# EasyEDA Pro project 同反向放大加减法通板.eprj

# Schematic Schematic1
Board Name: Board1; Create Date: 2024-07-23; Page Name: P1; Project Name: 同反向放大加减法通板; Schematic Name: Schematic1; Update Date: 2025-07-16; Company: 嘉立创EDA; Page Size: A4; Version: V1.0
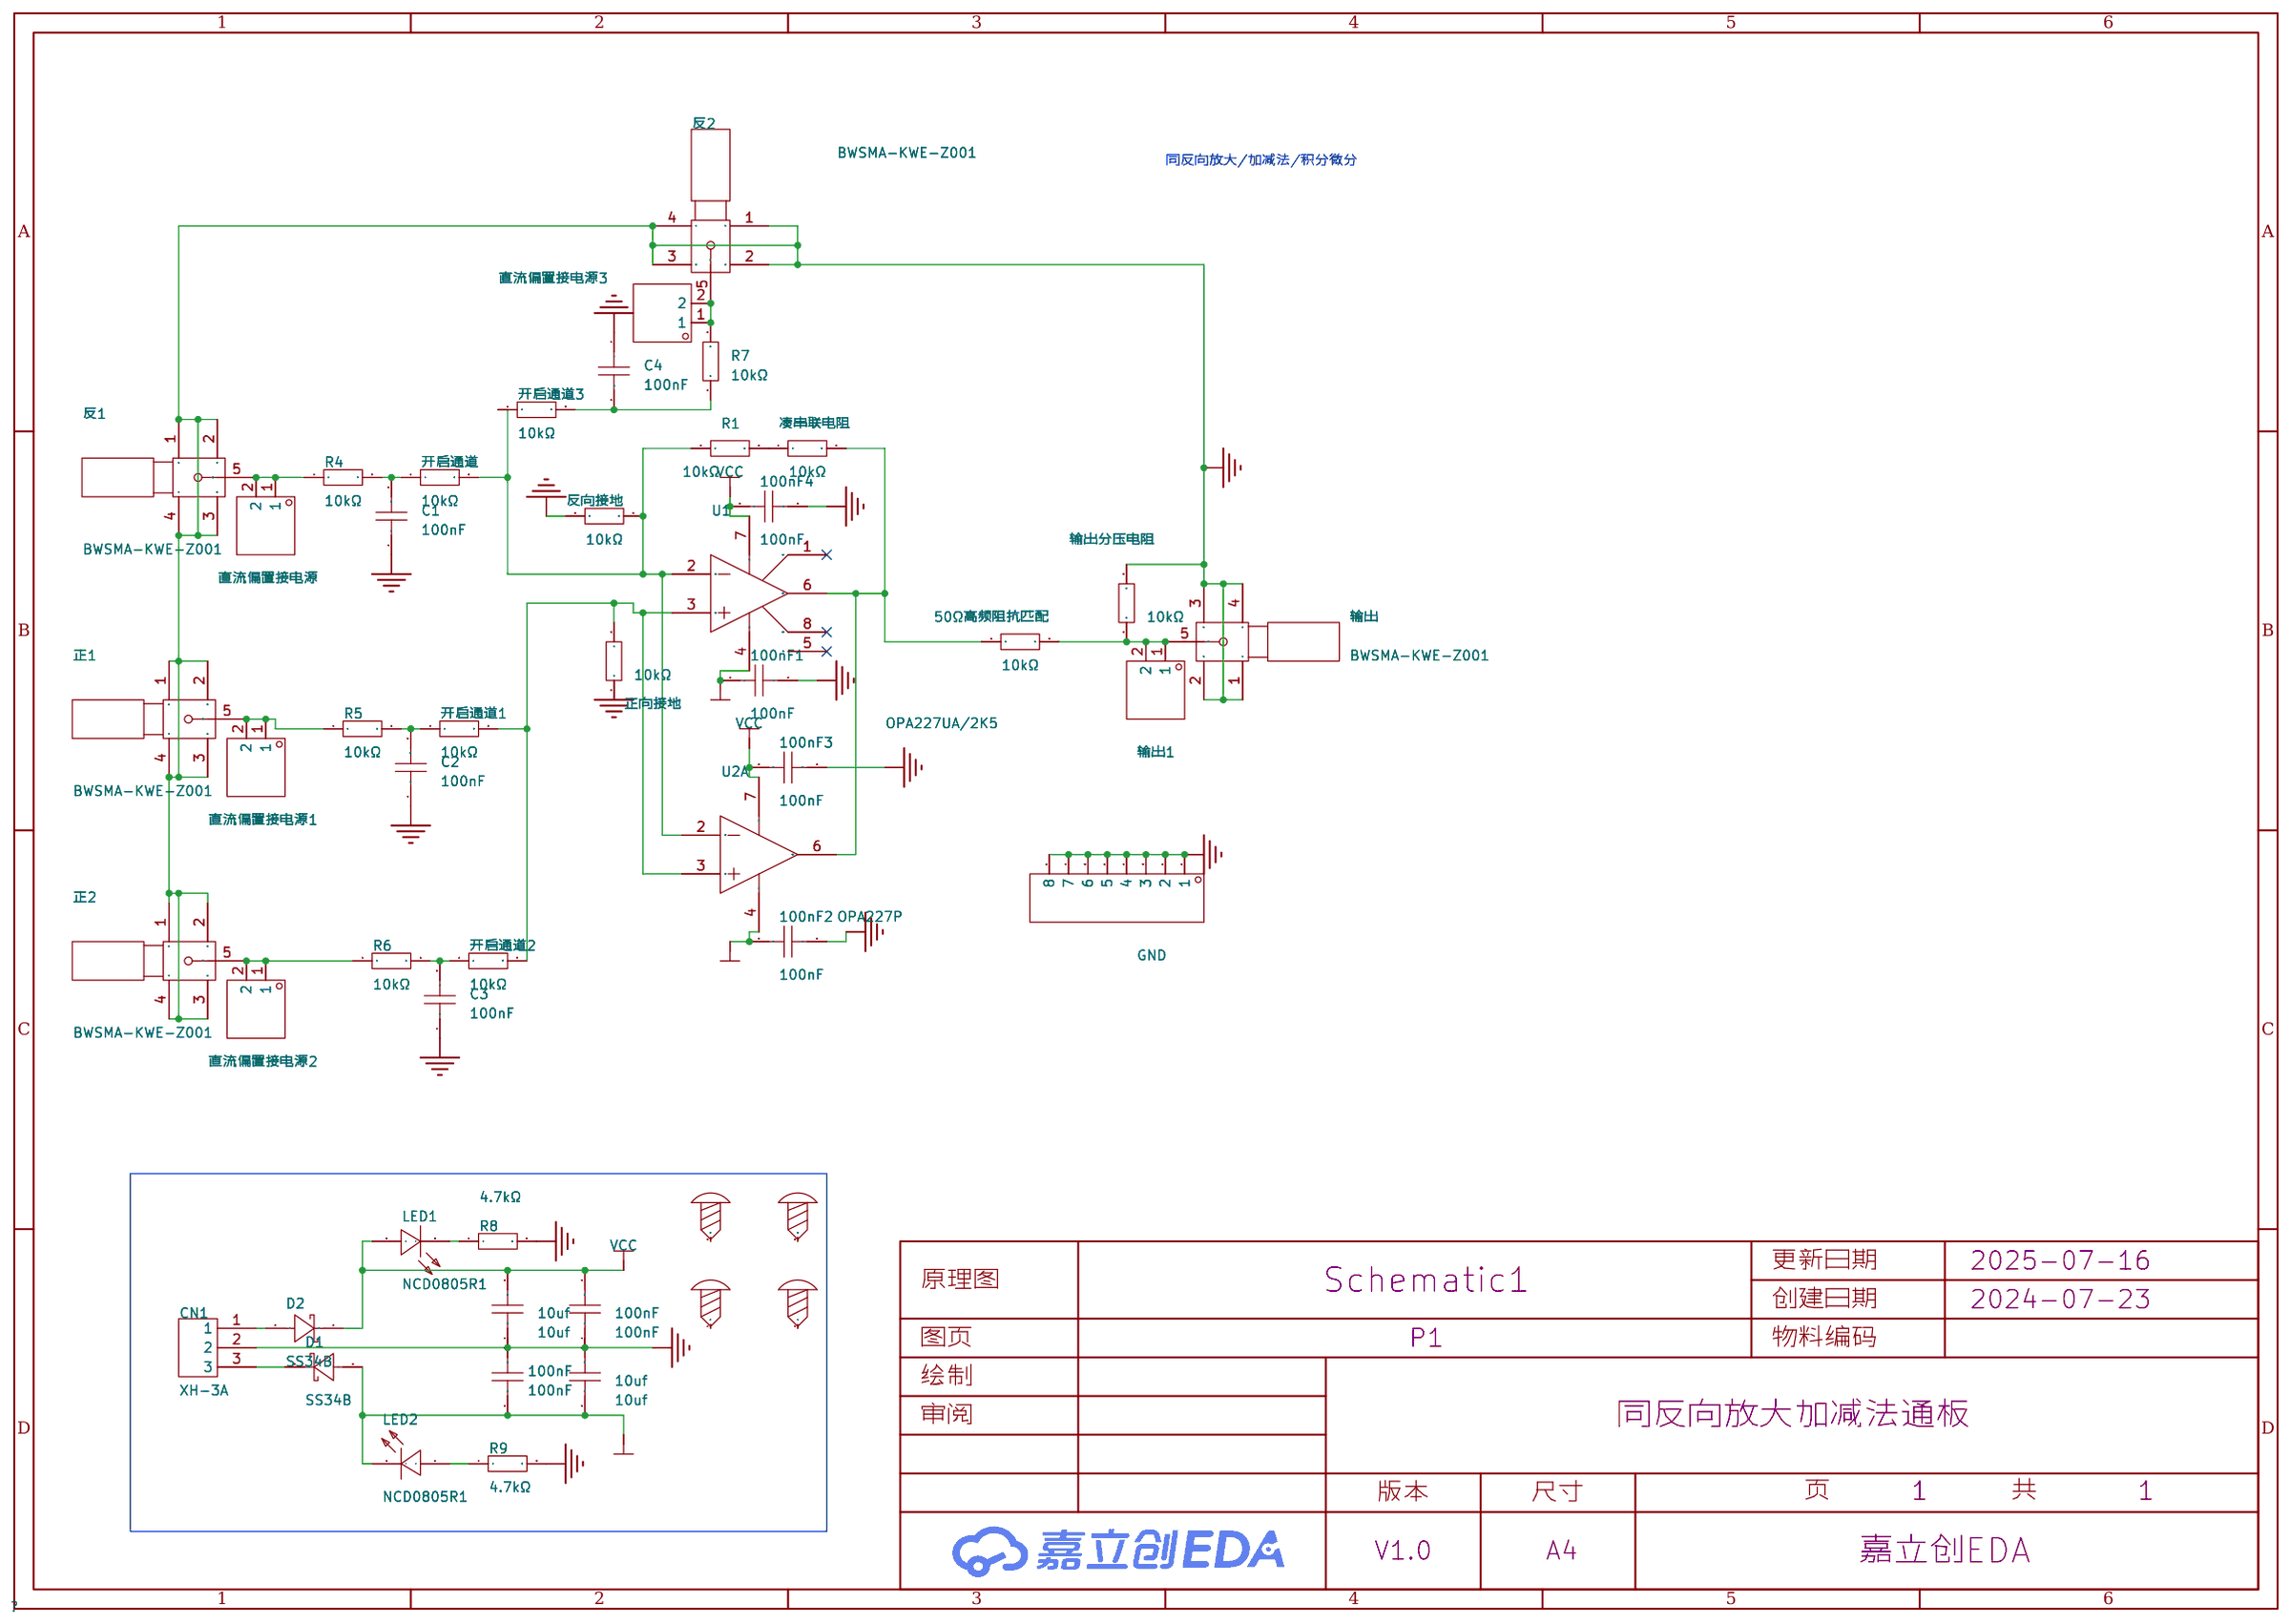
[diagram p0: schematic sheet]

## Parts
10uf  10uf  [C0805]
10uf#2  10uf  [C0805]
50Ω高频阻抗匹配  10kΩ  [R0805]
100nF  100nF  [C0805]
100nF1  100nF  [C0805]
100nF2  100nF  [C0805]
100nF3  100nF  [C0805]
100nF4  100nF  [C0805]
100nF#2  100nF  [C0805]
C1  100nF  [C0805]
C2  100nF  [C0805]
C3  100nF  [C0805]
C4  100nF  [C0805]
CN1  XH-3A  [CONN-TH_XH-3A]
D1  SS34B  [SMB_L4.6-W3.5-LS5.3-RD]
D2  SS34B  [SMB_L4.6-W3.5-LS5.3-RD]
GND  -  [HDR-TH_8P-P2.54-V-M]
LED1  NCD0805R1  [LED0805-R-RD]
LED2  NCD0805R1  [LED0805-R-RD]
R1  10kΩ  [R0805]
R4  10kΩ  [R0805]
R5  10kΩ  [R0805]
R6  10kΩ  [R0805]
R7  10kΩ  [R0805]
R8  4.7kΩ  [R0805]
R9  4.7kΩ  [R0805]
SCREW1  -  [M3螺丝]
SCREW2  -  [M3螺丝]
SCREW3  -  [M3螺丝]
SCREW4  -  [M3螺丝]
U1  OPA227UA/2K5  [SOIC-8_L4.9-W3.9-P1.27-LS6.0-BL]
U2  OPA227P  [PDIP-8_L9.3-W6.4-P2.54-LS7.9-BL-1]  (section 1)
凑串联电阻  10kΩ  [R0805]
反1  BWSMA-KWE-Z001  [SMA-TH_BWSMA-KWE-Z001]
反2  BWSMA-KWE-Z001  [SMA-TH_BWSMA-KWE-Z001]
反向接地  10kΩ  [R0805]
开启通道  10kΩ  [R0805]
开启通道1  10kΩ  [R0805]
开启通道2  10kΩ  [R0805]
开启通道3  10kΩ  [R0805]
正1  BWSMA-KWE-Z001  [SMA-TH_BWSMA-KWE-Z001]
正2  BWSMA-KWE-Z001  [SMA-TH_BWSMA-KWE-Z001]
正向接地  10kΩ  [R0805]
直流偏置接电源  -  [HDR-TH_2P-P2.54-V-M-1]
直流偏置接电源1  -  [HDR-TH_2P-P2.54-V-M-1]
直流偏置接电源2  -  [HDR-TH_2P-P2.54-V-M-1]
直流偏置接电源3  -  [HDR-TH_2P-P2.54-V-M-1]
输出  BWSMA-KWE-Z001  [SMA-TH_BWSMA-KWE-Z001]
输出1  -  [HDR-TH_2P-P2.54-V-M-1]
输出分压电阻  10kΩ  [R0805]

## Library data of the parts
10uf 10uf#2 100nF 100nF1-100nF4 100nF#2 C1-C4 = CC0805KRX7R9BB104: 容值:100nF;精度:±10%;额定电压:50V;材质(温度系数):X7R;; LCSC Part Name: 100nF ±10% 50V; Supplier Part: C49678; Manufacturer: YAGEO(国巨); Supplier Footprint: 0805; JLCPCB Part Class: Basic Part; Datasheet: https://atta.szlcsc.com/upload/public/pdf/source/20180224/C181747_15194369449651363981.pdf; Supplier: LCSC; Tolerance: ±10%; Voltage Rated: 50V; Temperature Coefficient: X7R
50Ω高频阻抗匹配 R1 R4-R9 凑串联电阻 反向接地 开启通道 开启通道1-开启通道3 正向接地 输出分压电阻 = 0805W8F1002T5E_C17414: 电阻类型:厚膜电阻;阻值:10kΩ;精度:±1%;功率:125mW;最大工作电压:150V;温度系数:±100ppm/℃;; LCSC Part Name: 10kΩ ±1% 125mW 厚膜电阻; Supplier Part: C17414; Manufacturer: UNI-ROYAL(厚声); Manufacturer Part: 0805W8F1002T5E; Supplier Footprint: 0805; JLCPCB Part Class: Basic Part; Datasheet: https://atta.szlcsc.com/upload/public/pdf/source/20200306/C422600_1E6D84923E4A46A82E41ADD87F860B5C.pdf; Supplier: LCSC; Type: 厚膜电阻; Tolerance: ±1%; Power(Watts): 125mW; Overload Voltage (Max): 150V; Temperature Coefficient: ±100ppm/℃; Operating Temperature Range: -55℃~+155℃
CN1 = XH-3A_C2316: 插针结构:1x3P;间距:2.5mm;安装方式:-;参考系列:XH;总PIN数:3P;排数:1;每排PIN数:3;行距:-;触头材质:-;; LCSC Part Name: 1x3P 间距:2.5mm 系列:XH; Supplier Part: C2316; Manufacturer: BOOMELE(博穆精密); Supplier Footprint: 插件,P=2.5mm; JLCPCB Part Class: Extended Part; Datasheet: https://atta.szlcsc.com/upload/public/pdf/source/20151222/1457707654251.pdf; Supplier: LCSC; Pins Structure: 1x3P; Pitch: 2.5mm; Reference Series: XH; Number of Pins: 3P; Number of Rows: 1; Number of PINs Per Row: 3
D1 D2 = SS34B_C7420366: LCSC Part Name: 电压:40V 电流:3A; Supplier Part: C7420366; Manufacturer: 宏嘉诚; Supplier Footprint: SMB; JLCPCB Part Class: 扩展库; Datasheet: https://atta.szlcsc.com/upload/public/pdf/source/20250121/6ECF561C2C3BC4B2993ABD3B603F350E.pdf; Supplier: LCSC; Diode Configuration: 独立式; Voltage - Forward(Vf@If): 550mV@3.0A; Voltage - DC Reverse(Vr): 40V; Current - Rectified: 3A; Reverse Leakage Current (Ir): 200uA@40V
GND = HDR-M_2.54_1x8P: Supplier Part: C124381; Supplier Footprint: 插件
LED1 LED2 = NCD0805R1: 灯头类型:-;发光颜色:红色;正向电压(VF):1.6V~2.6V;功率:65mW;正向电流:20mA;主波长:615nm~630nm;二极管配置:独立二极管;透镜颜色:无色透明透镜;色温:-;发光强度:67mcd~195mcd;发光角度:130°;载带方式:-;工作温度:-30℃~+85℃;; Supplier Part: C84256; Manufacturer: 国星光电; Supplier Footprint: 0805; JLCPCB Part Class: Basic Part; Datasheet: https://atta.szlcsc.com/upload/public/pdf/source/20200820/C84256_F0A75A43B3EAD75808600A0514C76B99.pdf; Supplier: LCSC; Emitted Color: 红色; Forward Voltage (VF): 1.6V~2.6V; Power Dissipation: 65mW; Forward Current: 20mA; Dominant Wavelength: 615nm~630nm; Diode Configuration: 独立二极管; Lens Color: 无色透明透镜; Luminous Intensity: 67mcd~195mcd; Viewing Angle: 130°; Operating Temperature: -30℃~+85℃
SCREW1-SCREW4 = M3螺丝: Supplier Footprint: 插件
U1 = OPA227UA/2K5: 放大器数:单路;增益带宽积(GBP):8MHz;输入偏置电流(Ib):2.5nA;压摆率(SR):2.3V/us;轨到轨:-;; Supplier Part: C456278; Manufacturer: TI(德州仪器); Supplier Footprint: SOIC-8; JLCPCB Part Class: Extended Part; Datasheet: https://www.ti.com/cn/lit/gpn/opa227; Supplier: LCSC; Number of Circuits: 单路; Gain Bandwidth Product(GBP): 8MHz; Current - Input Bias(Ib): 2.5nA; Slew Rate(SR): 2.3V/us; Output Current: 45mA; Operating Temperature: -40℃~+85℃
U2 = OPA227P: 放大器数:单路;增益带宽积(GBP):8MHz;输入偏置电流(Ib):2.5nA;压摆率(SR):2.3V/us;轨到轨:-;; Supplier Part: C1348575; Manufacturer: TI(德州仪器); Supplier Footprint: PDIP-8; JLCPCB Part Class: Extended Part; Datasheet: https://www.ti.com/cn/lit/gpn/opa4228; Supplier: LCSC; Number of Circuits: 单路; Gain Bandwidth Product(GBP): 8MHz; Current - Input Bias(Ib): 2.5nA; Slew Rate(SR): 2.3V/us; Output Current: 45mA; Operating Temperature: -40℃~+85℃
反1 反2 正1 正2 输出 = BWSMA-KWE-Z001: 连接器类型:板端;接口类型:内孔;端口数量:1;接口直径:5.3mm;接口长度/高度:-;频率-最大值:-;射频系列:SMA;阻抗:50Ω;样式:弯头;触头材质:-;触头镀层:-;工作温度范围:-;焊接温度(最大值):-;; LCSC Part Name: 内孔 SMA 弯头; Supplier Part: C496551; Manufacturer: BAT WIRELESS(蝙蝠无线); Supplier Footprint: 插件; JLCPCB Part Class: Extended Part; Datasheet: https://atta.szlcsc.com/upload/public/pdf/source/20231017/997A8C2ADA7F8034A89BE1264F38CE52.pdf; Supplier: LCSC; Connector Type: 板端; Interface Type: 内孔; Number of Ports: 1; Interface Diameter: 5.3mm; RF Series: SMA; Impedance: 50Ω; Style: 弯头
直流偏置接电源 直流偏置接电源1-直流偏置接电源3 输出1 = HDR-M_2.54_1x2P: Supplier Part: C124375; Supplier Footprint: 插件

## Nets
GND: 10uf.1 10uf#2.2 100nF.1 100nF1.1 100nF2.1 100nF3.1 100nF4.1 100nF#2.2 C1.1 C2.1 C3.1 C4.1 CN1.2 GND.1 GND.2 GND.3 GND.4 GND.5 GND.6 GND.7 GND.8 R8.2 R9.2 反1.1 反1.2 反1.3 反1.4 反2.1 反2.2 反2.3 反2.4 反向接地.2 正1.1 正1.2 正1.3 正1.4 正2.1 正2.2 正2.3 正2.4 正向接地.1 输出.1 输出.2 输出.3 输出.4 输出分压电阻.2
VCC: 10uf.2 100nF.2 100nF3.2 100nF4.2 D2.1(K) LED1.1(+) U1.7(VCC) U2.7(V+)
VEE: 10uf#2.1 100nF1.2 100nF2.2 100nF#2.1 D1.2(A) LED2.2(-) U1.4(VSS) U2.4(V-)
$1N1330: R1.2 凑串联电阻.1
$1N1539: 50Ω高频阻抗匹配.2 输出.5 输出1.1 输出1.2 输出分压电阻.1
$1N2313: R4.1 反1.5 直流偏置接电源.1 直流偏置接电源.2
$1N2329: R5.1 正1.5 直流偏置接电源1.1 直流偏置接电源1.2
$1N2343: R6.1 正2.5 直流偏置接电源2.1 直流偏置接电源2.2
$1N2447: R7.2 反2.5 直流偏置接电源3.1 直流偏置接电源3.2
$1N2462: C4.2 R7.1 开启通道3.2
$1N2689: 50Ω高频阻抗匹配.1 U1.6(OUT) U2.6(OUT) 凑串联电阻.2
$1N5425: LED1.2(-) R8.1
$1N5450: LED2.1(+) R9.1
Net-(C1-2): C1.2 R4.2 开启通道.1
Net-(C2-2): C2.2 R5.2 开启通道1.1
Net-(C3-2): C3.2 R6.2 开启通道2.1
Net-(CN1-1): CN1.1 D2.2(A)
Net-(CN1-3): CN1.3 D1.1(K)
Net-(R1-1): R1.1 U1.2(VIN-) U2.2(IN(-)) 反向接地.1 开启通道.2 开启通道3.1
Net-(U1-3): U1.3(VIN+) U2.3(IN(+)) 开启通道1.2 开启通道2.2 正向接地.2

Not connected (* = marked no-connect by the designer): SCREW1 1; SCREW2 1; SCREW3 1; SCREW4 1; U1 1(TRIM)* 5(NC)* 8(TRIM)*

## Notes on the sheet
- 同反向放大/加减法/积分微分

# Schematic Schematic1_1
Board Name: 新; Create Date: 2025-07-27; Page Name: 新; Project Name: 同反向放大加减法通板; Schematic Name: Schematic1_1; Update Date: 2025-07-27; Company: 嘉立创EDA; Page Size: A4; Version: V1.0
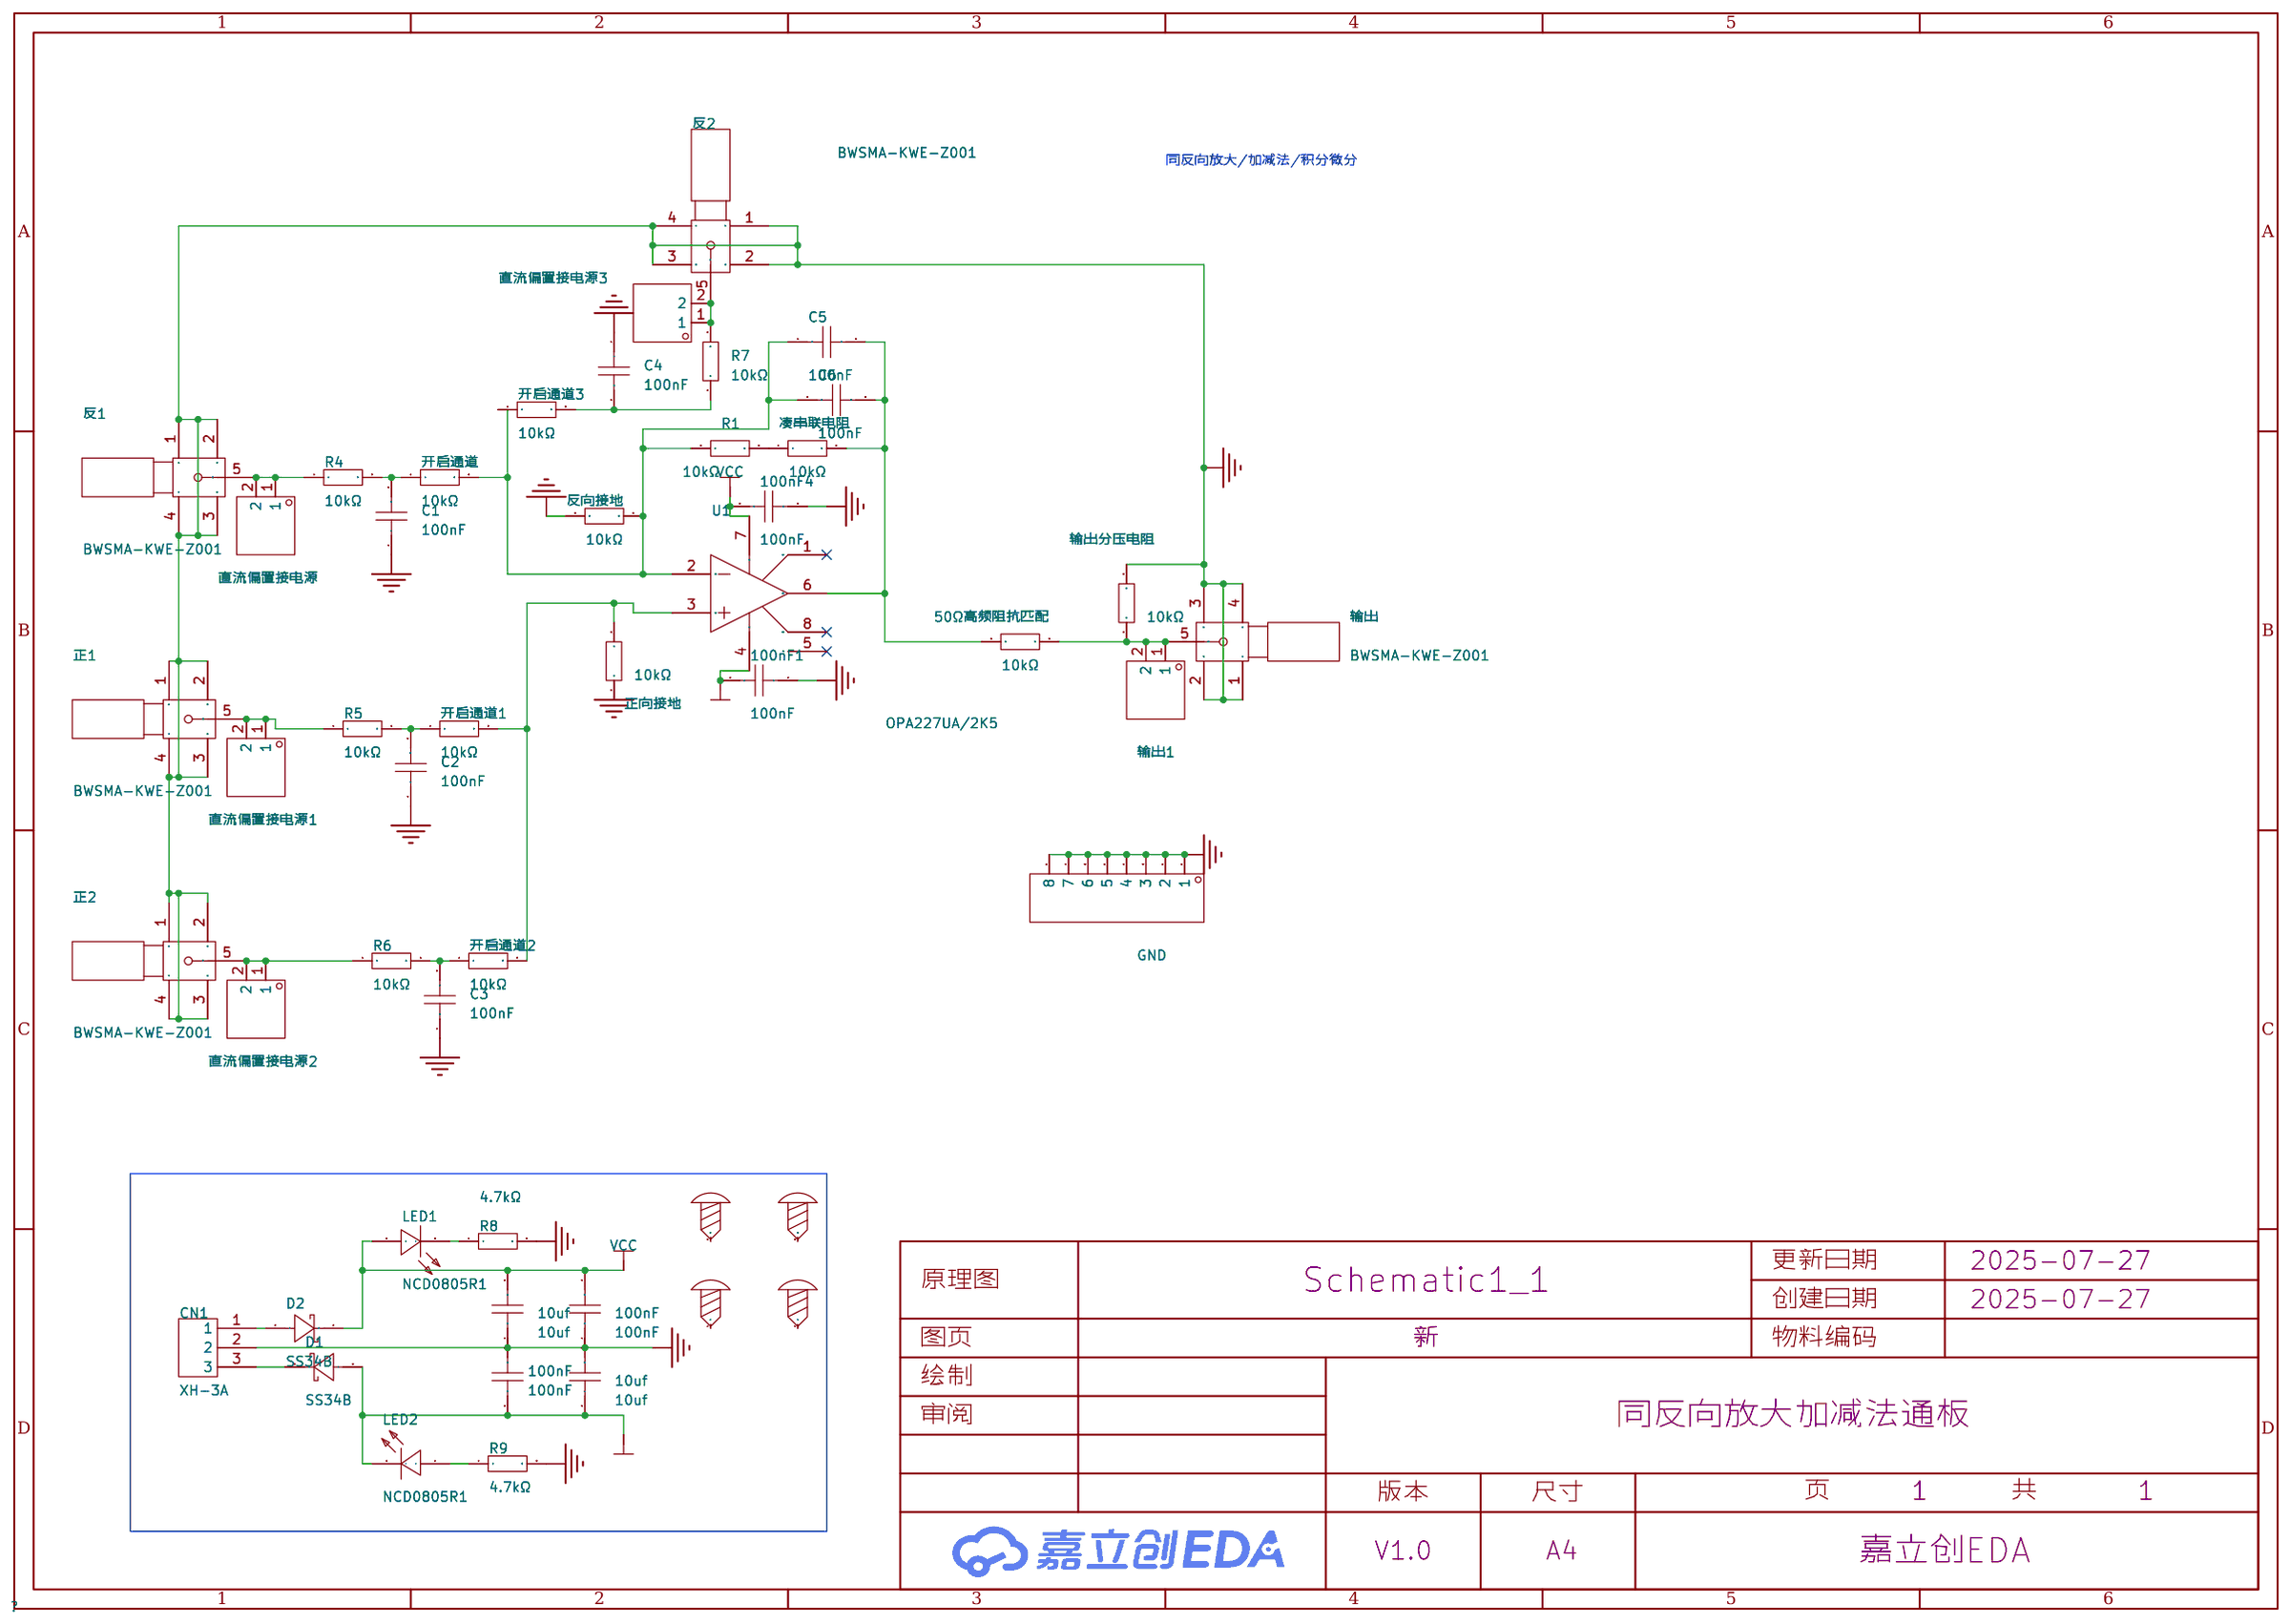
[diagram p1: schematic sheet]

## Parts
10uf  10uf  [C0805]
10uf#2  10uf  [C0805]
50Ω高频阻抗匹配  10kΩ  [R0805]
100nF  100nF  [C0805]
100nF1  100nF  [C0805]
100nF4  100nF  [C0805]
100nF#2  100nF  [C0805]
C1  100nF  [C0805]
C2  100nF  [C0805]
C3  100nF  [C0805]
C4  100nF  [C0805]
C5  100nF  [C0805]
C6  100nF  [C0805]
CN1  XH-3A  [CONN-TH_XH-3A]
D1  SS34B  [SMB_L4.6-W3.5-LS5.3-RD]
D2  SS34B  [SMB_L4.6-W3.5-LS5.3-RD]
GND  -  [HDR-TH_8P-P2.54-V-M]
LED1  NCD0805R1  [LED0805-R-RD]
LED2  NCD0805R1  [LED0805-R-RD]
R1  10kΩ  [R0805]
R4  10kΩ  [R0805]
R5  10kΩ  [R0805]
R6  10kΩ  [R0805]
R7  10kΩ  [R0805]
R8  4.7kΩ  [R0805]
R9  4.7kΩ  [R0805]
SCREW1  -  [M3螺丝]
SCREW2  -  [M3螺丝]
SCREW3  -  [M3螺丝]
SCREW4  -  [M3螺丝]
U1  OPA227UA/2K5  [SOIC-8_L4.9-W3.9-P1.27-LS6.0-BL]
凑串联电阻  10kΩ  [R0805]
反1  BWSMA-KWE-Z001  [SMA-TH_BWSMA-KWE-Z001]
反2  BWSMA-KWE-Z001  [SMA-TH_BWSMA-KWE-Z001]
反向接地  10kΩ  [R0805]
开启通道  10kΩ  [R0805]
开启通道1  10kΩ  [R0805]
开启通道2  10kΩ  [R0805]
开启通道3  10kΩ  [R0805]
正1  BWSMA-KWE-Z001  [SMA-TH_BWSMA-KWE-Z001]
正2  BWSMA-KWE-Z001  [SMA-TH_BWSMA-KWE-Z001]
正向接地  10kΩ  [R0805]
直流偏置接电源  -  [HDR-TH_2P-P2.54-V-M-1]
直流偏置接电源1  -  [HDR-TH_2P-P2.54-V-M-1]
直流偏置接电源2  -  [HDR-TH_2P-P2.54-V-M-1]
直流偏置接电源3  -  [HDR-TH_2P-P2.54-V-M-1]
输出  BWSMA-KWE-Z001  [SMA-TH_BWSMA-KWE-Z001]
输出1  -  [HDR-TH_2P-P2.54-V-M-1]
输出分压电阻  10kΩ  [R0805]

## Library data of the parts
10uf 10uf#2 100nF 100nF1 100nF4 100nF#2 C1-C4 = CC0805KRX7R9BB104: 容值:100nF;精度:±10%;额定电压:50V;材质(温度系数):X7R;; LCSC Part Name: 100nF ±10% 50V; Supplier Part: C49678; Manufacturer: YAGEO(国巨); Supplier Footprint: 0805; JLCPCB Part Class: Basic Part; Datasheet: https://atta.szlcsc.com/upload/public/pdf/source/20180224/C181747_15194369449651363981.pdf; Supplier: LCSC; Tolerance: ±10%; Voltage Rated: 50V; Temperature Coefficient: X7R
50Ω高频阻抗匹配 R1 R4-R9 凑串联电阻 反向接地 开启通道 开启通道1-开启通道3 正向接地 输出分压电阻 = 0805W8F1002T5E_C17414: 电阻类型:厚膜电阻;阻值:10kΩ;精度:±1%;功率:125mW;最大工作电压:150V;温度系数:±100ppm/℃;; LCSC Part Name: 10kΩ ±1% 125mW 厚膜电阻; Supplier Part: C17414; Manufacturer: UNI-ROYAL(厚声); Manufacturer Part: 0805W8F1002T5E; Supplier Footprint: 0805; JLCPCB Part Class: Basic Part; Datasheet: https://atta.szlcsc.com/upload/public/pdf/source/20200306/C422600_1E6D84923E4A46A82E41ADD87F860B5C.pdf; Supplier: LCSC; Type: 厚膜电阻; Tolerance: ±1%; Power(Watts): 125mW; Overload Voltage (Max): 150V; Temperature Coefficient: ±100ppm/℃; Operating Temperature Range: -55℃~+155℃
C5 C6 = FCC0805B104K500DT: LCSC Part Name: 100nF ±10% 50V; Supplier Part: C5137467; Manufacturer: FOJAN(富捷); Supplier Footprint: 0805; JLCPCB Part Class: Extended Part; Datasheet: https://atta.szlcsc.com/upload/public/pdf/source/20220818/0EB3B7FB2F5648AC16609637FBA7DABE.pdf; Supplier: LCSC; Tolerance: ±10%; Voltage Rating: 50V; Temperature Coefficient: X7R
CN1 = XH-3A_C2316: 插针结构:1x3P;间距:2.5mm;安装方式:-;参考系列:XH;总PIN数:3P;排数:1;每排PIN数:3;行距:-;触头材质:-;; LCSC Part Name: 1x3P 间距:2.5mm 系列:XH; Supplier Part: C2316; Manufacturer: BOOMELE(博穆精密); Supplier Footprint: 插件,P=2.5mm; JLCPCB Part Class: Extended Part; Datasheet: https://atta.szlcsc.com/upload/public/pdf/source/20151222/1457707654251.pdf; Supplier: LCSC; Pins Structure: 1x3P; Pitch: 2.5mm; Reference Series: XH; Number of Pins: 3P; Number of Rows: 1; Number of PINs Per Row: 3
D1 D2 = SS34B_C7420366: LCSC Part Name: 电压:40V 电流:3A; Supplier Part: C7420366; Manufacturer: 宏嘉诚; Supplier Footprint: SMB; JLCPCB Part Class: 扩展库; Datasheet: https://atta.szlcsc.com/upload/public/pdf/source/20250121/6ECF561C2C3BC4B2993ABD3B603F350E.pdf; Supplier: LCSC; Diode Configuration: 独立式; Voltage - Forward(Vf@If): 550mV@3.0A; Voltage - DC Reverse(Vr): 40V; Current - Rectified: 3A; Reverse Leakage Current (Ir): 200uA@40V
GND = HDR-M_2.54_1x8P: Supplier Part: C124381; Supplier Footprint: 插件
LED1 LED2 = NCD0805R1: 灯头类型:-;发光颜色:红色;正向电压(VF):1.6V~2.6V;功率:65mW;正向电流:20mA;主波长:615nm~630nm;二极管配置:独立二极管;透镜颜色:无色透明透镜;色温:-;发光强度:67mcd~195mcd;发光角度:130°;载带方式:-;工作温度:-30℃~+85℃;; Supplier Part: C84256; Manufacturer: 国星光电; Supplier Footprint: 0805; JLCPCB Part Class: Basic Part; Datasheet: https://atta.szlcsc.com/upload/public/pdf/source/20200820/C84256_F0A75A43B3EAD75808600A0514C76B99.pdf; Supplier: LCSC; Emitted Color: 红色; Forward Voltage (VF): 1.6V~2.6V; Power Dissipation: 65mW; Forward Current: 20mA; Dominant Wavelength: 615nm~630nm; Diode Configuration: 独立二极管; Lens Color: 无色透明透镜; Luminous Intensity: 67mcd~195mcd; Viewing Angle: 130°; Operating Temperature: -30℃~+85℃
SCREW1-SCREW4 = M3螺丝: Supplier Footprint: 插件
U1 = OPA227UA/2K5: 放大器数:单路;增益带宽积(GBP):8MHz;输入偏置电流(Ib):2.5nA;压摆率(SR):2.3V/us;轨到轨:-;; Supplier Part: C456278; Manufacturer: TI(德州仪器); Supplier Footprint: SOIC-8; JLCPCB Part Class: Extended Part; Datasheet: https://www.ti.com/cn/lit/gpn/opa227; Supplier: LCSC; Number of Circuits: 单路; Gain Bandwidth Product(GBP): 8MHz; Current - Input Bias(Ib): 2.5nA; Slew Rate(SR): 2.3V/us; Output Current: 45mA; Operating Temperature: -40℃~+85℃
反1 反2 正1 正2 输出 = BWSMA-KWE-Z001: 连接器类型:板端;接口类型:内孔;端口数量:1;接口直径:5.3mm;接口长度/高度:-;频率-最大值:-;射频系列:SMA;阻抗:50Ω;样式:弯头;触头材质:-;触头镀层:-;工作温度范围:-;焊接温度(最大值):-;; LCSC Part Name: 内孔 SMA 弯头; Supplier Part: C496551; Manufacturer: BAT WIRELESS(蝙蝠无线); Supplier Footprint: 插件; JLCPCB Part Class: Extended Part; Datasheet: https://atta.szlcsc.com/upload/public/pdf/source/20231017/997A8C2ADA7F8034A89BE1264F38CE52.pdf; Supplier: LCSC; Connector Type: 板端; Interface Type: 内孔; Number of Ports: 1; Interface Diameter: 5.3mm; RF Series: SMA; Impedance: 50Ω; Style: 弯头
直流偏置接电源 直流偏置接电源1-直流偏置接电源3 输出1 = HDR-M_2.54_1x2P: Supplier Part: C124375; Supplier Footprint: 插件

## Nets
GND: 10uf.1 10uf#2.2 100nF.1 100nF1.1 100nF4.1 100nF#2.2 C1.1 C2.1 C3.1 C4.1 CN1.2 GND.1 GND.2 GND.3 GND.4 GND.5 GND.6 GND.7 GND.8 R8.2 R9.2 反1.1 反1.2 反1.3 反1.4 反2.1 反2.2 反2.3 反2.4 反向接地.2 正1.1 正1.2 正1.3 正1.4 正2.1 正2.2 正2.3 正2.4 正向接地.1 输出.1 输出.2 输出.3 输出.4 输出分压电阻.2
VCC: 10uf.2 100nF.2 100nF4.2 D2.1(K) LED1.1(+) U1.7(VCC)
VEE: 10uf#2.1 100nF1.2 100nF#2.1 D1.2(A) LED2.2(-) U1.4(VSS)
Net-(50Ω高频阻抗匹配-1): 50Ω高频阻抗匹配.1 C5.2 C6.2 U1.6(OUT) 凑串联电阻.2
Net-(50Ω高频阻抗匹配-2): 50Ω高频阻抗匹配.2 输出.5 输出1.1 输出1.2 输出分压电阻.1
Net-(C1-2): C1.2 R4.2 开启通道.1
Net-(C2-2): C2.2 R5.2 开启通道1.1
Net-(C3-2): C3.2 R6.2 开启通道2.1
Net-(C4-2): C4.2 R7.1 开启通道3.2
Net-(C5-1): C5.1 C6.1 R1.1 U1.2(VIN-) 反向接地.1 开启通道.2 开启通道3.1
Net-(CN1-1): CN1.1 D2.2(A)
Net-(CN1-3): CN1.3 D1.1(K)
Net-(LED1-2): LED1.2(-) R8.1
Net-(LED2-1): LED2.1(+) R9.1
Net-(R1-2): R1.2 凑串联电阻.1
Net-(R4-1): R4.1 反1.5 直流偏置接电源.1 直流偏置接电源.2
Net-(R5-1): R5.1 正1.5 直流偏置接电源1.1 直流偏置接电源1.2
Net-(R6-1): R6.1 正2.5 直流偏置接电源2.1 直流偏置接电源2.2
Net-(R7-2): R7.2 反2.5 直流偏置接电源3.1 直流偏置接电源3.2
Net-(U1-3): U1.3(VIN+) 开启通道1.2 开启通道2.2 正向接地.2

Not connected (* = marked no-connect by the designer): SCREW1 1; SCREW2 1; SCREW3 1; SCREW4 1; U1 1(TRIM)* 5(NC)* 8(TRIM)*

## Notes on the sheet
- 同反向放大/加减法/积分微分

# Board PCB1
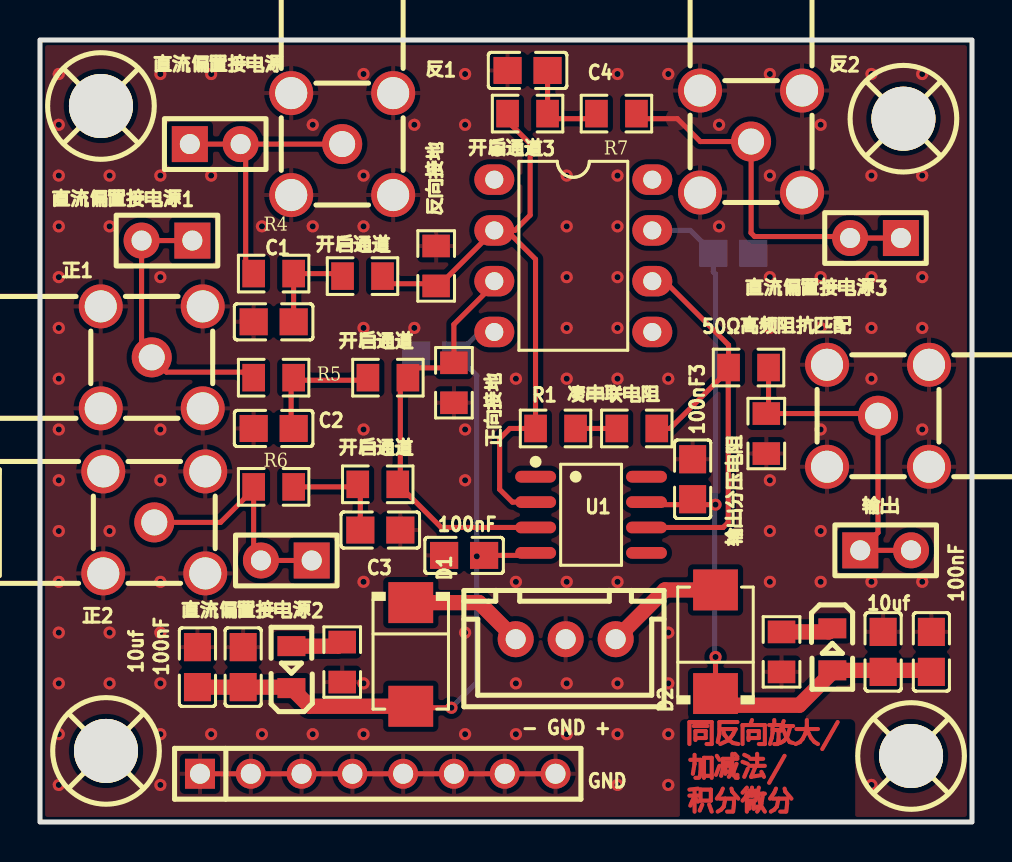
[diagram p2: board, top side]
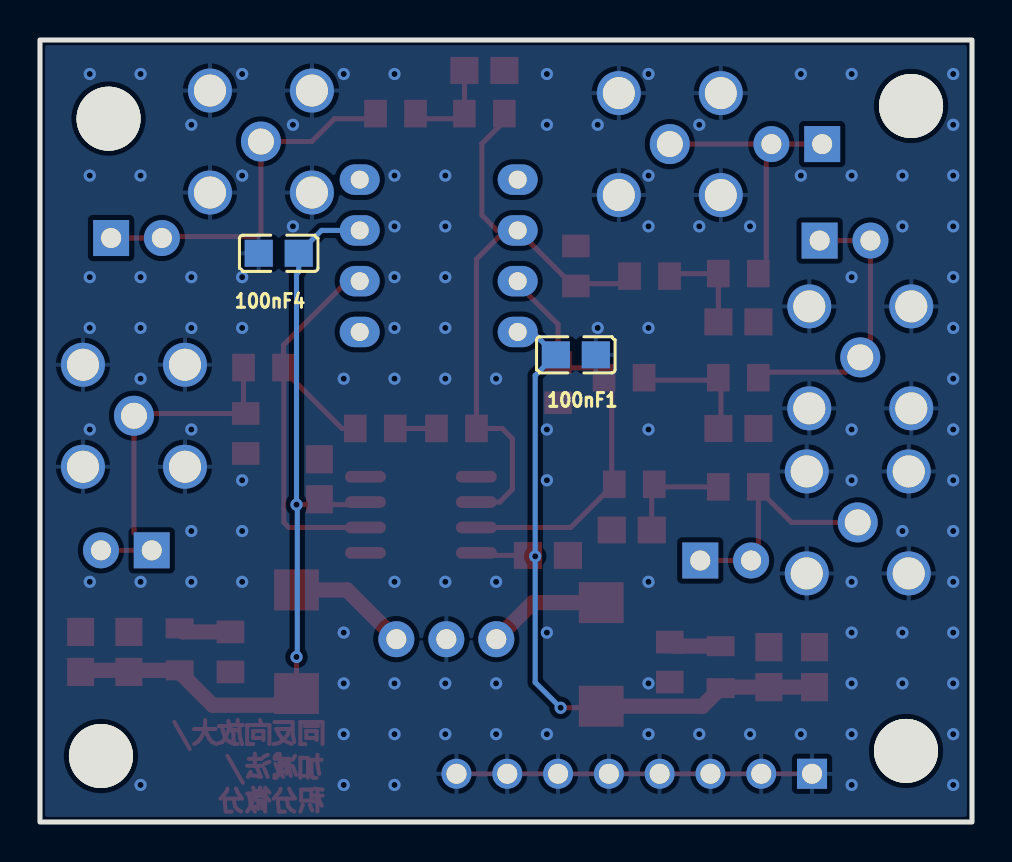
[diagram p3: board, bottom side, seen from below]

Outline 46.61 x 39.12 mm; copper layers: Top Layer, Bottom Layer. Coordinates in mm from the lower left corner of the outline.
Outline path: rectangle 0,39.12 46.61,0
Stack: Top Layer 0.035mm / Dielectric1 1.51mm FR4 er 4.5 / Bottom Layer 0.035mm

## Design rules (mm)
template: JLCPCB Capability(Two Layers Board)
spacing copperThickness1oz (default): track to track 0.102, other pairs 0.152 to 0.3
spacing copperThickness2oz: track to track 0.203, other pairs 0.152 to 0.3
track width copperThickness1oz (default): min 0.127, default 0.254, max 2.54
track width copperThickness2oz: min 0.203, default 0.254, max 2.54
differential pair differentialPair (default): width min 0.127, default 0.254, max 2.54; gap min 0.152, default 0.152
via viaSize (default): diameter min 0.5, default 0.61, max 10; hole min 0.3, default 0.305, max 6.3

## Placement (name value [footprint] x y rotation side)
10uf  10uf  [C0805]  44.58 8.51 270 top
10uf#2  10uf  [C0805]  7.87 7.75 90 top
50Ω高频阻抗匹配  10kΩ  [R0805]  35.43 22.73 0 top
100nF  100nF  [C0805]  42.16 8.51 270 top
100nF1  100nF  [C0805]  19.81 23.37 0 bottom
100nF3  100nF  [C0805]  32.64 17.14 270 top
100nF4  100nF  [C0805]  34.67 28.45 180 bottom
100nF#2  100nF  [C0805]  21.21 13.33 0 top
100nF#3  -  [C0805]  10.16 7.75 90 top
- GND +  XH-3A  [CONN-TH_XH-3A]  26.29 9.14 180 top
C1  100nF  [C0805]  11.68 25.02 0 top
C2  100nF  [C0805]  11.68 19.69 0 top
C3  100nF  [C0805]  17.02 14.61 180 top
C4  100nF  [C0805]  24.38 37.59 0 top
D1  SS34B  [SMB_L4.6-W3.5-LS5.3-RD]  18.54 8.38 270 top
D2  SS34B  [SMB_L4.6-W3.5-LS5.3-RD]  33.78 9.02 90 top
GND  -  [HDR-TH_8P-P2.54-V-M]  16.89 2.41 0 top
LED1  NCD0805R1  [LED0805-R-RD]  39.62 8.64 270 top
LED2  NCD0805R1  [LED0805-R-RD]  12.57 7.75 90 top
R1  10kΩ  [R0805]  25.78 19.69 0 top
R4  10kΩ  [R0805]  11.68 27.43 0 top
R5  10kΩ  [R0805]  11.68 22.22 0 top
R6  10kΩ  [R0805]  11.68 16.76 0 top
R7  10kΩ  [R0805]  28.83 35.43 0 top
R8  4.7kΩ  [R0805]  37.08 8.51 270 top
R9  4.7kΩ  [R0805]  15.11 8 270 top
SCREW1  -  [M3螺丝]  3.05 35.81 0 top
SCREW2  -  [M3螺丝]  43.18 35.18 0 top
SCREW3  -  [M3螺丝]  3.3 3.56 0 top
SCREW4  -  [M3螺丝]  43.56 3.3 0 top
U1  OPA227UA/2K5  [SOIC-8_L4.9-W3.9-P1.27-LS6.0-BL]  27.56 15.37 270 top
U2  OPA227P  [PDIP-8_L9.3-W6.4-P2.54-LS7.9-BL-1]  26.67 28.32 270 top
凑串联电阻  10kΩ  [R0805]  29.84 19.69 0 top
反1  BWSMA-KWE-Z001  [SMA-TH_BWSMA-KWE-Z001]  15.11 33.91 90 top
反2  BWSMA-KWE-Z001  [SMA-TH_BWSMA-KWE-Z001]  35.56 34.04 90 top
反向接地  10kΩ  [R0805]  19.81 27.81 90 top
开启通道  10kΩ  [R0805]  16.13 27.3 0 top
开启通道3  10kΩ  [R0805]  24.38 35.43 0 top
开启通道#2  -  [R0805]  17.4 22.22 0 top
开启通道#3  -  [R0805]  16.89 16.89 0 top
正1  BWSMA-KWE-Z001  [SMA-TH_BWSMA-KWE-Z001]  5.59 23.24 180 top
正2  BWSMA-KWE-Z001  [SMA-TH_BWSMA-KWE-Z001]  5.71 14.99 180 top
正向接地  10kΩ  [R0805]  20.7 21.97 90 top
直流偏置接电源  -  [HDR-TH_2P-P2.54-V-M-1]  8.76 33.91 0 top
直流偏置接电源1  -  [HDR-TH_2P-P2.54-V-M-1]  6.35 29.08 180 top
直流偏置接电源2  -  [HDR-TH_2P-P2.54-V-M-1]  12.32 13.08 180 top
直流偏置接电源3  -  [HDR-TH_2P-P2.54-V-M-1]  41.78 29.21 180 top
输出  BWSMA-KWE-Z001  [SMA-TH_BWSMA-KWE-Z001]  41.91 20.32 0 top
输出1  -  [HDR-TH_2P-P2.54-V-M-1]  42.29 13.59 0 top
输出分压电阻  10kΩ  [R0805]  36.32 19.43 270 top

## Footprints (pads in the part's own frame, mm; a bottom-side part is the same pattern mirrored in y, then rotated)
C0805
  rect 1.41x1.35 smd: 1(-1,0) 2(1,0)
CONN-TH_XH-3A
  round 1.8 hole 1: 1(-2.5,0) 2(0,0) 3(2.5,0)
HDR-TH_2P-P2.54-V-M-1
  rect 1.8x1.8 hole 1: 1(-1.27,0)
  round 1.8 hole 1: 2(1.27,0)
HDR-TH_8P-P2.54-V-M
  rect 1.5x1.5 hole 1: 1(-8.89,0)
  round 1.5 hole 1: 2(-6.35,0) 3(-3.81,0) 4(-1.27,0) 5(1.27,0) 6(3.81,0) 7(6.35,0) 8(8.89,0)
LED0805-R-RD
  rect 1x1.399 smd: 1(1.05,0) 2(-1.05,0)
M3螺丝
  round 3.2 hole 3.2: 1(0,0)
PDIP-8_L9.3-W6.4-P2.54-LS7.9-BL-1
  oval 1.524x2 hole 0.9: 1(-3.81,-3.95) 2(-1.27,-3.95) 3(1.27,-3.95) 4(3.81,-3.95) 5(3.81,3.95) 6(1.27,3.95) 7(-1.27,3.95) 8(-3.81,3.95)
R0805
  rect 1.133x1.377 smd: 1(-1,0) 2(1,0)
SMA-TH_BWSMA-KWE-Z001
  round 2.2 hole 1.6: 1(-2.55,-2.55) 2(-2.55,2.55) 3(2.55,2.55) 4(2.55,-2.55)
  round 2 hole 1.3: 5(0,0)
SMB_L4.6-W3.5-LS5.3-RD
  rect 2.047x2.241 smd: 1(-2.591,0) 2(2.591,0)
SOIC-8_L4.9-W3.9-P1.27-LS6.0-BL
  oval 0.588x2.045 smd: 1(-1.905,-2.772) 2(-0.635,-2.772) 3(0.635,-2.772) 4(1.905,-2.772) 5(1.905,2.772) 6(0.635,2.772) 7(-0.635,2.772) 8(-1.905,2.772)

## Nets
GND: 10uf.1 10uf#2.2 100nF.1 100nF1.1 100nF3.1 100nF4.1 100nF#2.1 100nF#3.2 - GND +.2 C1.1 C2.1 C3.1 C4.1 GND.1 GND.2 GND.3 GND.4 GND.5 GND.6 GND.7 GND.8 R8.2 R9.2 反1.1 反1.2 反1.3 反1.4 反2.1 反2.2 反2.3 反2.4 反向接地.2 正1.1 正1.2 正1.3 正1.4 正2.1 正2.2 正2.3 正2.4 正向接地.1 输出.1 输出.2 输出.3 输出.4 输出分压电阻.2
VCC: 10uf.2 100nF.2 100nF3.2 100nF4.2 D2.1 LED1.1 U1.7 U2.7
VEE: 10uf#2.1 100nF1.2 100nF#2.2 100nF#3.1 D1.2 LED2.2 U1.4 U2.4
$1N1330: R1.2 凑串联电阻.1
$1N1539: 50Ω高频阻抗匹配.2 输出.5 输出1.1 输出1.2 输出分压电阻.1
$1N2313: R4.1 反1.5 直流偏置接电源.1 直流偏置接电源.2
$1N2329: R5.1 正1.5 直流偏置接电源1.1 直流偏置接电源1.2
$1N2340: C2.2 R5.2 开启通道#2.1
$1N2343: R6.1 正2.5 直流偏置接电源2.1 直流偏置接电源2.2
$1N2357: C3.2 R6.2 开启通道#3.1
$1N2360: C1.2 R4.2 开启通道.1
$1N2447: R7.2 反2.5 直流偏置接电源3.1 直流偏置接电源3.2
$1N2462: C4.2 R7.1 开启通道3.2
$1N2666: U1.3 U2.3 开启通道#2.2 开启通道#3.2 正向接地.2
$1N2689: 50Ω高频阻抗匹配.1 U1.6 U2.6 凑串联电阻.2
$1N3241: R1.1 U1.2 U2.2 反向接地.1 开启通道.2 开启通道3.1
$1N5425: LED1.2 R8.1
$1N5450: LED2.1 R9.1
$1N6559: - GND +.3 D1.1
$1N6606: - GND +.1 D2.2

Pads without a net: SCREW1 1; SCREW2 1; SCREW3 1; SCREW4 1; U1 1 5 8; U2 1 5 8

## Via types
v1: diameter 0.61, hole 0.305, Top Layer to Bottom Layer, 114 vias

## Routing (per net, layer and track width the routed paths; a pad name or vN(x,y) marks a point on that pad's centre or on a via; arc(x,y) is an arc through that point)
GND: length 17.8
  Top Layer w0.254: 25.78,2.41 GND.7 GND.6 GND.4 GND.3 GND.2 GND.1
  vias: v1(0.94,37.41) v1(0.94,34.87) v1(0.94,32.33) v1(0.94,29.79) v1(0.94,27.25) v1(0.94,24.71) v1(0.94,22.17) v1(0.94,19.63) v1(0.94,17.09) v1(0.94,14.55) v1(0.94,12.01) v1(0.94,9.47) v1(0.94,6.93) v1(0.94,4.39) v1(0.94,1.85) v1(3.48,32.33) v1(3.48,29.79) v1(3.48,14.55) v1(3.48,9.47) v1(3.48,6.93) v1(6.02,37.41) v1(6.02,32.33) v1(6.02,27.25) v1(6.02,19.63) v1(6.02,17.09) v1(6.02,12.01) v1(6.02,9.47) v1(6.02,6.93) v1(6.02,4.39) v1(6.02,1.85) v1(8.56,37.41) v1(8.56,32.33) v1(8.56,4.39) v1(11.1,29.79) v1(11.1,4.39) v1(13.64,34.87) v1(13.64,29.79) v1(13.64,4.39) v1(16.18,37.41) v1(16.18,32.33) v1(16.18,29.79) v1(16.18,24.71) v1(16.18,19.63) v1(16.18,12.01) v1(16.18,6.93) v1(16.18,4.39) v1(18.72,34.87) v1(18.72,24.71) v1(21.26,37.41) v1(21.26,34.87) v1(21.26,19.63) v1(21.26,17.09) v1(21.26,9.47) v1(21.26,4.39) v1(23.8,22.17) v1(23.8,12.01) v1(23.8,6.93) v1(23.8,4.39) v1(26.34,32.33) v1(26.34,29.79) v1(26.34,27.25) v1(26.34,24.71) v1(26.34,22.17) v1(26.34,12.01) v1(26.34,6.93) v1(26.34,4.39) v1(28.88,37.41) v1(28.88,32.33) v1(28.88,29.79) v1(28.88,27.25) v1(28.88,24.71) v1(28.88,22.17) v1(28.88,12.01) v1(28.88,6.93) v1(28.88,4.39) v1(28.88,1.85) v1(31.42,37.41) v1(31.42,22.17) v1(31.42,9.47) v1(31.42,6.93) v1(31.42,4.39) v1(31.42,1.85) v1(33.96,34.87) v1(33.96,29.79) v1(36.5,37.41) v1(36.5,32.33) v1(36.5,27.25) v1(36.5,24.71) v1(36.5,17.09) v1(36.5,14.55) v1(36.5,12.01) v1(39.04,34.87) v1(39.04,27.25) v1(39.04,24.71) v1(39.04,19.63) v1(39.04,14.55) v1(39.04,12.01) v1(41.58,37.41) v1(41.58,32.33) v1(41.58,27.25) v1(41.58,24.71) v1(41.58,22.17) v1(41.58,12.01) v1(41.58,1.85) v1(44.12,37.41) v1(44.12,32.33) v1(44.12,27.25) v1(44.12,24.71) v1(44.12,19.63) v1(44.12,12.01)
VCC: length 40.6
  Top Layer w0.254: v1(33.78,15.88) 30.46,15.88 U1.7 ; v1(33.78,8.25) D2.1
  Top Layer w0.762: 10uf.2 44.5,7.59 LED1.1 39.62,7.49 37.97,5.84 34.37,5.84 D2.1
  Bottom Layer w0.254: 33.74,8.25 33.74,15.83 v1(33.78,15.88) 33.78,27.41 33.67,27.52 100nF4.2 32.53,29.59 31,29.59
VEE: length 36.9
  Top Layer w0.254: v1(20.57,5.72) 18.8,5.72 18.73,5.79 ; 100nF#2.2 24.66,13.33 U1.4
  Top Layer w0.762: D1.2 13.48,5.79 LED2.2 12.52,6.75 100nF#3.1 10uf#2.1
  Bottom Layer w0.254: 100nF1.2 21.84,22.34 v1(21.84,13.29) 21.84,6.98 v1(20.57,5.72) ; 23.1,24.51 21.98,24.51 20.84,23.37
$1N1330: length 2.8
  Top Layer w0.254: 26.4,19.69 28.97,19.69 29.1,19.81
$1N1539: length 17.6
  Top Layer w0.254: 43.56,13.59 输出1.1 41.91,14.48 输出.5 41.8,20.43 输出分压电阻.1 36.43,20.54 50Ω高频阻抗匹配.2
$1N2313: length 14.3
  Top Layer w0.254: 9.52,34.17 9.51,34.16 9.52,34.16 ; 反1.5 直流偏置接电源.2 10.29,33.66 10.29,27.19 10.56,26.92 ; 直流偏置接电源.1 9.52,33.91
$1N2329: length 14
  Top Layer w0.254: 直流偏置接电源1.1 直流偏置接电源1.2 5.08,23.75 正1.5 6.33,22.5 10.15,22.5 10.56,22.1
$1N2340: length 6.1
  Top Layer w0.254: 12.68,19.94 12.56,20.07 12.56,22.1 16.27,22.1 开启通道#2.1
$1N2343: length 12.2
  Top Layer w0.254: 正2.5 9.03,14.99 10.68,16.64 ; 直流偏置接电源2.2 10.68,13.45 10.68,16.64 ; 10.68,16.64 R6.1 ; 11.56,13.08 14.1,13.08 13.97,12.95
$1N2357: length 5.2
  Top Layer w0.254: 开启通道#3.1 16.02,16.76 C3.2 ; R6.2 15.51,16.76
$1N2360: length 5.3
  Top Layer w0.254: 15.13,26.92 14.62,27.43 R4.2 12.68,24.77
$1N2447: length 18.5
  Top Layer w0.254: 直流偏置接电源3.1 直流偏置接电源3.2 40.44,29.28 35.74,29.28 35.56,29.46 反2.5 33.02,34.04 31.88,35.18 29.7,35.18
$1N2462: length 4.9
  Top Layer w0.254: 25,35.18 27.7,35.18 ; C4.2 开启通道3.2
$1N2666: length 21.2
  Top Layer w0.254: U1.3 20.07,14.73 18.02,16.78 18.02,22.1 18.64,22.72 20.45,22.72 正向接地.2 20.7,24.89 22.86,27.05 23.1,27.05
$1N2689: length 21.8
  Top Layer w0.254: 50Ω高频阻抗匹配.1 34.43,23.86 31.24,27.05 31,27.05 ; 31.02,14.73 34.16,14.73 34.42,14.99 34.42,22.59 31.51,19.69 凑串联电阻.2
$1N3241: length 31.2
  Top Layer w0.254: 17.13,26.92 19.7,26.92 反向接地.1 19.93,26.81 22.71,29.59 23.34,29.59 ; 23.64,35.18 23.64,34.8 24.51,33.93 24.51,30.35 23.75,29.59 23.34,29.59 ; U1.2 23.62,16 22.99,16.64 22.99,19.18 23.49,19.69 R1.1 24.78,28.15 23.34,29.59
$1N5425: length 2.6
  Top Layer w0.762: LED1.2 39.45,9.51 R8.1
$1N5450: length 2.6
  Top Layer w0.762: R9.1 14.91,8.8 LED2.1
$1N6559: length 6
  Top Layer w0.762: - GND +.3 21.96,10.97 D1.1
$1N6606: length 6
  Top Layer w0.762: - GND +.1 31.25,11.61 D2.2

## Copper pours and planes (outline as drawn; the poured copper is in the pictures)
GND on Top Layer: -2.29,40.39 48.39,40.39 48.39,-1.4 -2.29,-1.4
GND on Bottom Layer: -3.17,42.42 51.18,42.42 51.18,-2.41 -3.17,-2.41

## Text on the board
Top Layer: 同反向放大/ / 加减法/ / 积分微分

# Board 新
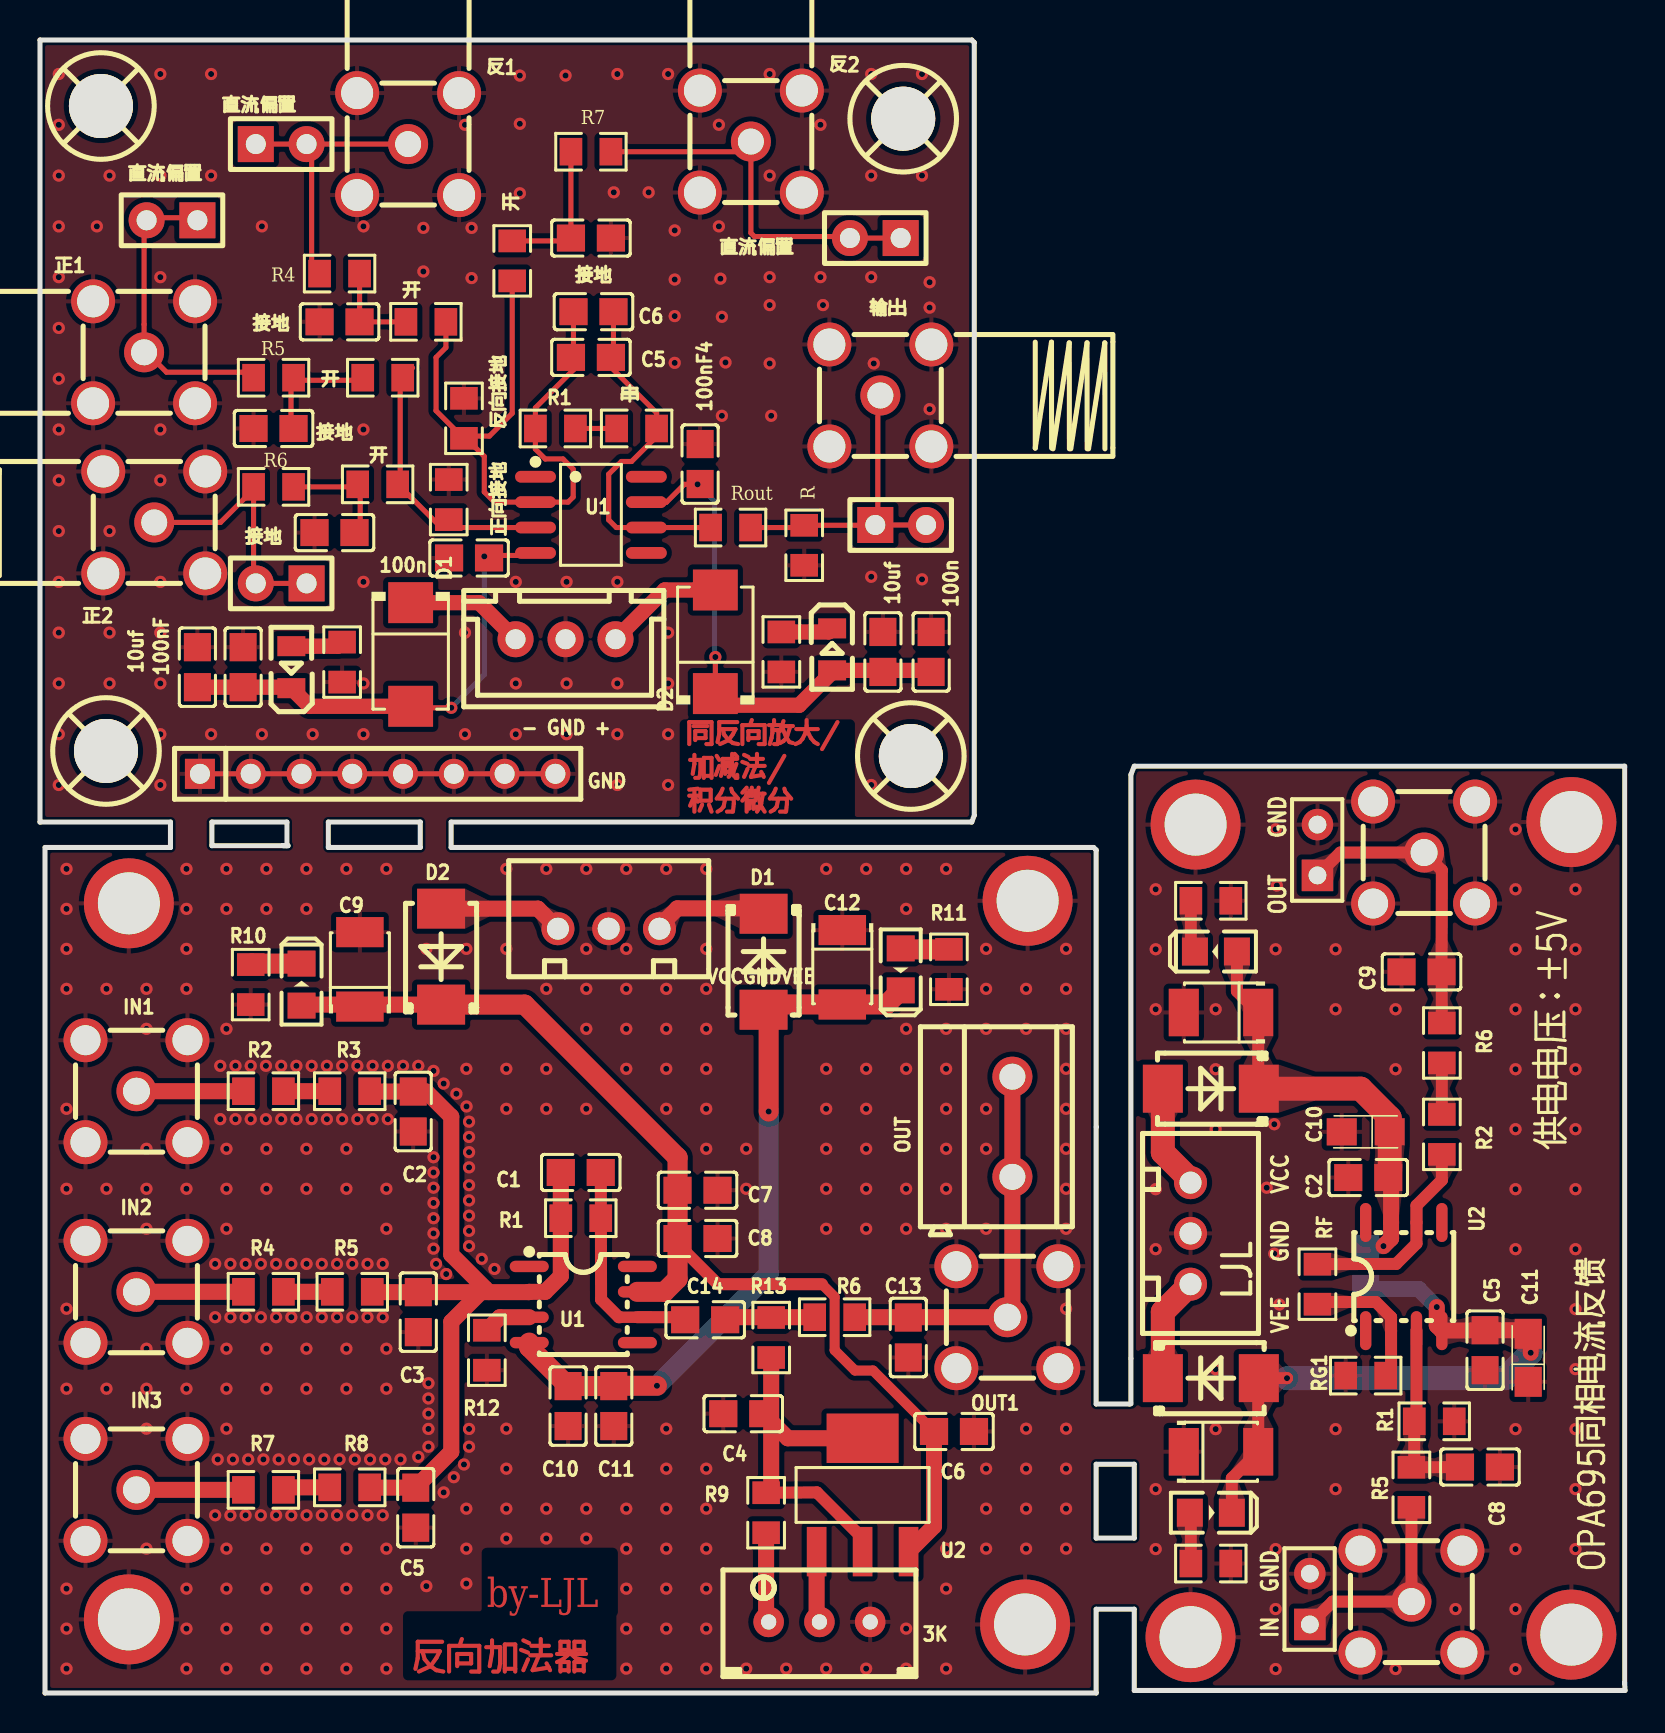
[diagram p4: board, top side]
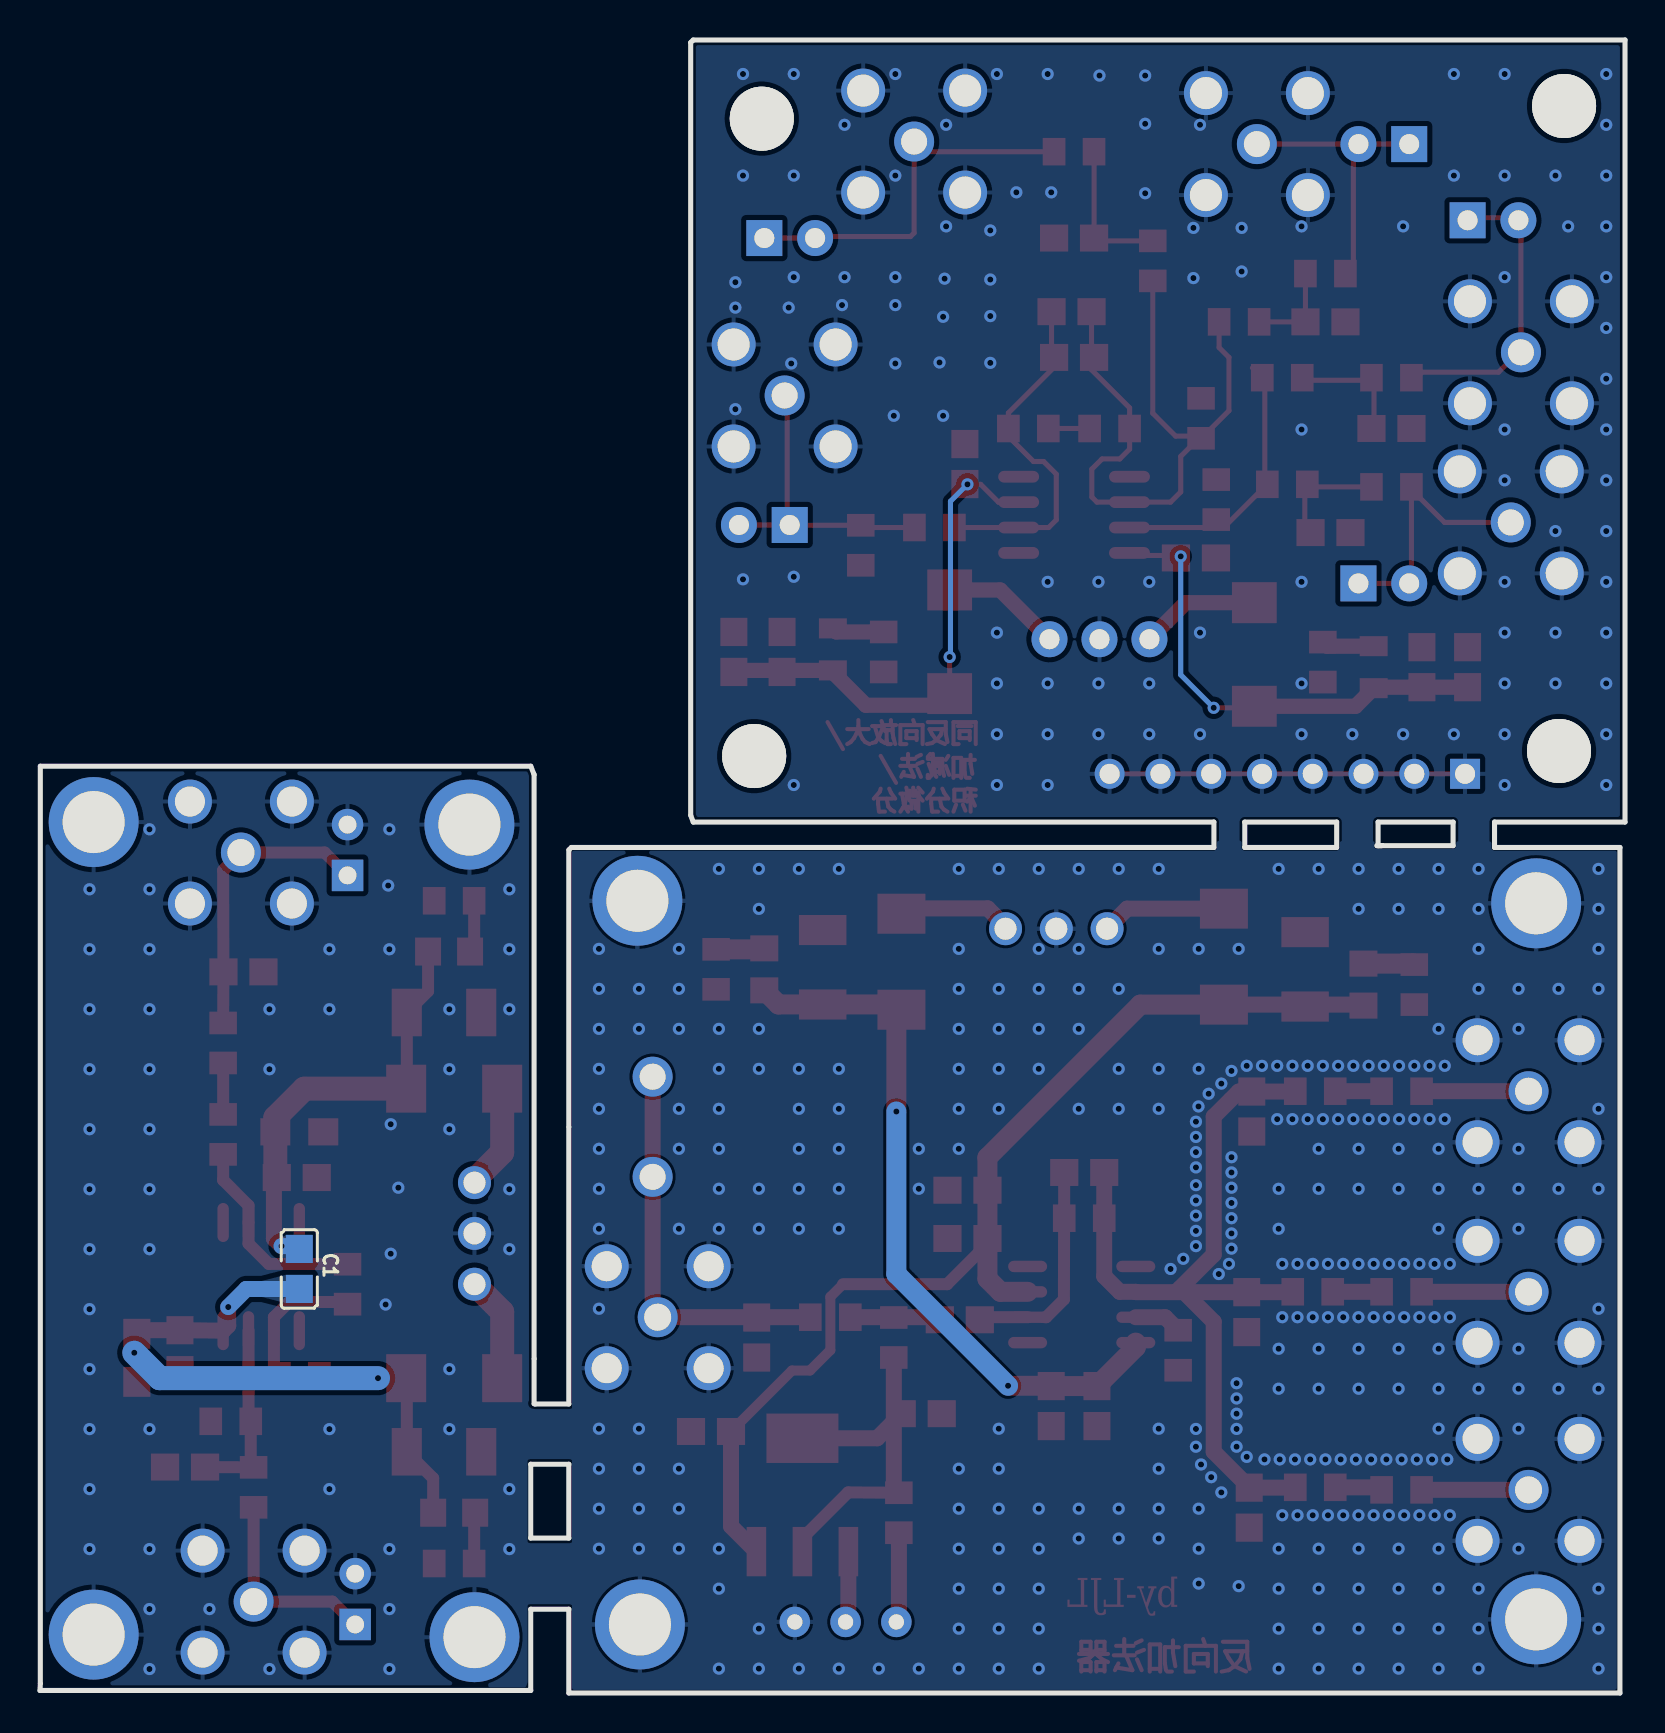
[diagram p5: board, bottom side, seen from below]

Outline 79.29 x 82.68 mm; copper layers: Top Layer, Bottom Layer. Coordinates in mm from the lower left corner of the outline.
Outline path: 0,82.68 0,43.56 6.53,43.56 6.53,42.29 0.25,42.29 0.25,0 52.83,0 52.83,4.19 54.74,4.19 54.74,0.13 79.29,0.13 79.27,0.49 79.27,46.36 54.74,46.36 54.57,45.93 54.57,14.47 54.51,14.46 52.83,14.46 52.83,42.16 52.7,42.29 20.57,42.29 20.57,43.56 46.61,43.56 46.74,43.9 46.74,82.55 46.61,82.68 0,82.68 ; 8.6,43.56 8.6,42.38 12.41,42.38 12.15,42.39 12.35,42.39 12.35,43.56 8.6,43.56 ; 14.42,43.56 19.02,43.56 19.02,42.29 14.42,42.29 14.42,43.56 ; 52.83,11.44 54.74,11.44 54.74,7.75 52.83,7.75 52.83,11.44
Stack: Top Layer 0.035mm / Dielectric1 1.51mm FR4 er 4.5 / Bottom Layer 0.035mm

## Design rules (mm)
template: JLCPCB Capability(Two Layers Board)
spacing copperThickness1oz (default): track to track 0.102, other pairs 0.152 to 0.3
spacing copperThickness2oz: track to track 0.203, other pairs 0.152 to 0.3
track width copperThickness1oz (default): min 0.127, default 0.254, max 2.54
track width copperThickness2oz: min 0.203, default 0.254, max 2.54
differential pair differentialPair (default): width min 0.127, default 0.254, max 2.54; gap min 0.152, default 0.152
via viaSize (default): diameter min 0.5, default 0.61, max 10; hole min 0.3, default 0.305, max 6.3

## Placement (name value [footprint] x y rotation side)
3K  R_3296W_US  [RES-ADJ-TH_3296W]  38.99 3.56 90 top
10uf  10uf  [C0805]  44.58 52.07 270 top
10uf#2  10uf  [C0805]  7.87 51.31 90 top
100n  -  [C0805]  42.16 52.07 270 top
100n#2  -  [C0805]  21.46 56.77 0 top
100nF  100nF  [C0805]  10.16 51.31 90 top
100nF4  100nF  [C0805]  33.02 61.47 270 top
- GND +  XH-3A  [CONN-TH_XH-3A]  26.29 52.71 180 top
C1  100nF  [C0805]  27.05 26.04 180 top
C1#2  -  [C0805]  66.31 21.21 90 bottom
C2  100nF  [C0805]  18.67 29.08 270 top
C2#2  -  [C0805]  66.44 25.78 0 top
C3  100nF  [CASE-B_3528]  59.08 34.04 180 top
C3#2  -  [C0805]  18.92 19.05 90 top
C4  100nF  [C0805]  35.18 13.97 180 top
C5  100nF  [C0805]  72.28 17.15 270 top
C5#2  -  [C0805]  18.8 9.27 270 top
C5#3  -  [C0805]  27.56 66.8 0 top
C6  100nF  [CASE-B_3528]  59.08 12.06 0 top
C6#2  -  [C0805]  45.72 13.08 0 top
C6#3  -  [C0805]  27.69 69.09 0 top
C7  100n  [C0805]  32.89 25.15 180 top
C8  -  [C0805]  32.89 22.73 180 top
C8#2  -  [C0805]  72.03 11.3 180 top
C9  -  [CASE-B_3528]  16 36.19 90 top
C9#2  -  [C0805]  69.11 36.07 0 top
C10  -  [C0805]  26.42 14.35 270 top
C10#2  -  [CASE-A_3216]  66.31 28.07 180 top
C11  -  [C0805]  28.7 14.35 270 top
C11#2  -  [CASE-A_3216]  74.44 16.76 90 top
C12  47u  [CASE-B_3528]  40.13 36.3 270 top
C13  NC  [C0805]  43.43 17.78 90 top
C14  100n  [C0805]  33.27 18.67 0 top
D1  SS34B  [SMB_L4.4-W3.6-LS5.3-RD]  58.57 15.75 0 top
D1#2  -  [SMB_L4.4-W3.6-LS5.3-RD]  36.2 36.58 270 top
D1#3  -  [SMB_L4.6-W3.5-LS5.3-RD]  18.54 51.94 270 top
D2  SS34B  [SMB_L4.4-W3.6-LS5.3-RD]  20.06 36.83 90 top
D2#2  -  [SMB_L4.4-W3.6-LS5.3-RD]  58.57 30.23 180 top
D2#3  -  [SMB_L4.6-W3.5-LS5.3-RD]  33.78 52.58 90 top
D3  SMA-直插  [SMA-TH_BWSMA-KE-Z001]  68.6 4.57 90 top
GND  -  [HDR-TH_8P-P2.54-V-M]  16.89 45.97 0 top
H1  HDR-F-2.54_1x2  [HDR-F-2.54_1X2]  63.52 4.7 90 top
H2  HDR-F-2.54_1x2  [HDR-F-2.54_1X2]  63.9 42.16 90 top
IN1  SMA-直插  [SMA-TH_BWSMA-KE-Z001]  4.83 30.1 0 top
IN2  SMA-直插  [SMA-TH_BWSMA-KE-Z001]  4.83 20.07 0 top
IN3  SMA-直插  [SMA-TH_BWSMA-KE-Z001]  4.83 10.16 90 top
LED1  NCD0805R1  [LED0805-R-RD]  39.62 52.2 270 top
LED1#2  -  [LED0805_GREEN]  13.08 35.43 90 top
LED1#3  -  [LED0805_GREEN]  58.82 37.09 180 top
LED2  NCD0805R1  [LED0805-R-RD]  12.57 51.31 90 top
LED2#2  -  [LED0805_GREEN]  43.05 36.19 270 top
LED2#3  -  [LED0805_GREEN]  58.57 9.02 0 top
OUT  -  [CONN-TH_2P-P5.00]  48.64 28.32 90 top
OUT1  SMA-直插  [SMA-TH_BWSMA-KE-Z001]  48.39 18.8 180 top
R  10kΩ  [R0805]  38.23 57.4 270 top
R1  10kΩ  [R0805]  69.74 13.59 180 top
R1#2  -  [R0805]  27.05 23.75 0 top
R1#3  -  [R0805]  25.78 63.25 0 top
R2  -  [R0805]  11.18 30.1 0 top
R2#2  -  [R0805]  70.12 27.94 270 top
R3  500  [R0805]  15.49 30.1 0 top
R4  10kΩ  [R0805]  11.18 20.07 0 top
R4#2  -  [R0805]  14.99 70.99 0 top
R5  10kΩ  [R0805]  15.62 20.07 0 top
R5#2  -  [R0805]  68.6 10.29 90 top
R5#3  -  [R0805]  11.68 65.79 0 top
R6  10kΩ  [R0805]  39.75 18.8 0 top
R6#2  -  [R0805]  11.68 60.33 0 top
R6#3  -  [R0805]  70.12 32.51 270 top
R7  10kΩ  [R0805]  58.57 6.48 180 top
R7#2  -  [R0805]  11.18 10.16 0 top
R7#3  -  [R0805]  27.56 77.09 0 top
R8  4.7kΩ  [R0805]  58.57 39.62 180 top
R8#2  -  [R0805]  15.49 10.29 0 top
R8#3  -  [R0805]  37.08 52.07 270 top
R9  4.7kΩ  [R0805]  36.32 9.02 90 top
R9#2  -  [R0805]  15.11 51.56 270 top
R10  3k  [R0805]  10.54 35.43 90 top
R11  3k  [R0805]  45.47 36.2 90 top
R12  500  [R0805]  22.35 17.15 90 top
R13  1k  [R0805]  36.58 17.78 90 top
RF  402  [R0805]  63.9 20.45 90 top
RG1  56.2  [R0805]  66.31 15.88 0 top
Rout  10kΩ  [R0805]  34.54 58.29 0 top
S1  SMA-直插  [SMA-TH_BWSMA-KE-Z001]  69.23 42.04 90 top
SCREW1  -  [M3螺丝]  3.05 79.38 0 top
SCREW2  -  [M3螺丝]  43.18 78.74 0 top
SCREW3  -  [M3螺丝]  3.3 47.12 0 top
SCREW4  -  [M3螺丝]  43.56 46.86 0 top
T1  -  [螺丝孔-3MM]  57.55 2.79 90 top
T1#2  -  [螺丝孔-3MM]  49.28 3.43 0 top
T2  -  [螺丝孔-3MM]  4.44 39.5 180 top
T2#2  -  [螺丝孔-3MM]  76.6 2.92 90 top
T3  -  [螺丝孔-3MM]  57.81 43.43 90 top
T3#2  -  [螺丝孔-3MM]  4.44 3.68 0 top
T4  -  [螺丝孔-3MM]  49.4 39.62 0 top
T4#2  -  [螺丝孔-3MM]  76.6 43.56 90 top
U1  OPA227UA/2K5  [SOIC-8_L4.9-W3.9-P1.27-LS6.0-BL]  27.56 58.93 270 top
U1#2  -  [SOIC-8_L5.0-W4.0-P1.27-LS6.1-BL]  27.18 19.43 270 top
U2  -  [SOIC-8_L5.0-W4.0-P1.27-LS6.1-BL]  68.22 20.83 0 top
U2#2  -  [SOT-223-4_L6.5-W3.5-P2.30-LS7.0-BR]  41.15 9.91 270 top
VCCGNDVEE  HDR-F-2.54_1x3  [CONN-TH_XH2.54_3PIN]  28.45 38.23 180 top
VCCGNDVEE1  HDR-F-2.54_1x3  [CONN-TH_XH2.54_3PIN]  57.55 22.99 90 top
串  10kΩ  [R0805]  29.84 63.25 0 top
反1  BWSMA-KWE-Z001  [SMA-TH_BWSMA-KWE-Z001]  18.41 77.47 90 top
反2  BWSMA-KWE-Z001  [SMA-TH_BWSMA-KWE-Z001]  35.56 77.6 90 top
反向接地  10kΩ  [R0805]  21.21 63.75 90 top
开  -  [R0805]  19.3 68.58 0 top
开#2  -  [R0805]  17.14 65.79 0 top
开#3  -  [R0805]  16.89 60.45 0 top
开#4  -  [R0805]  23.62 71.63 90 top
接地  -  [C0805]  14.99 68.58 0 top
接地#2  -  [C0805]  11.68 63.25 0 top
接地#3  -  [C0805]  14.73 58.04 0 top
接地#4  -  [C0805]  27.56 72.77 180 top
正1  BWSMA-KWE-Z001  [SMA-TH_BWSMA-KWE-Z001]  5.21 67.06 180 top
正2  BWSMA-KWE-Z001  [SMA-TH_BWSMA-KWE-Z001]  5.72 58.55 180 top
正向接地  10kΩ  [R0805]  20.45 59.69 270 top
直流偏置  -  [HDR-TH_2P-P2.54-V-M-1]  12.06 77.47 0 top
直流偏置#2  -  [HDR-TH_2P-P2.54-V-M-1]  6.6 73.66 180 top
直流偏置#3  -  [HDR-TH_2P-P2.54-V-M-1]  41.78 72.77 180 top
直流偏置接电源2  -  [HDR-TH_2P-P2.54-V-M-1]  12.06 55.5 180 top
输出  BWSMA-KWE-Z001  [SMA-TH_BWSMA-KWE-Z001]  42.04 64.9 0 top
输出1  -  [HDR-TH_2P-P2.54-V-M-1]  43.05 58.42 0 top

## Footprints (pads in the part's own frame, mm; a bottom-side part is the same pattern mirrored in y, then rotated)
C0805
  rect 1.41x1.35 smd: 1(-1,0) 2(1,0)
CASE-A_3216
  rect 1.5x1.359 smd: 1(-1.2,0) 2(1.2,0)
CASE-B_3528
  rect 1.506x2.376 smd: 1(-1.861,0) 2(1.861,0)
CONN-TH_2P-P5.00
  round 2 hole 1.3: 1(-2.505,0) 2(2.505,0)
CONN-TH_XH2.54_3PIN
  round 1.65 hole 1.1: 1(-2.54,0) 2(0,0) 3(2.54,0)
CONN-TH_XH-3A
  round 1.8 hole 1: 1(-2.5,0) 2(0,0) 3(2.5,0)
HDR-F-2.54_1X2
  rect 1.575x1.575 hole 0.889: 1(-1.27,0)
  round 1.575 hole 0.889: 2(1.27,0)
HDR-TH_2P-P2.54-V-M-1
  rect 1.8x1.8 hole 1: 1(-1.27,0)
  round 1.8 hole 1: 2(1.27,0)
HDR-TH_8P-P2.54-V-M
  rect 1.5x1.5 hole 1: 1(-8.89,0)
  round 1.5 hole 1: 2(-6.35,0) 3(-3.81,0) 4(-1.27,0) 5(1.27,0) 6(3.81,0) 7(6.35,0) 8(8.89,0)
LED0805-R-RD
  rect 1x1.399 smd: 1(1.05,0) 2(-1.05,0)
LED0805_GREEN
  rect 1.3x1.399 smd: 1(-1.05,0) 2(1.05,0)
M3螺丝
  round 3.2 hole 3.2: 1(0,0)
R0805
  rect 1.133x1.377 smd: 1(-1,0) 2(1,0)
RES-ADJ-TH_3296W
  round 1.524 hole 0.762: 1(0,2.54) 2(0,0) 3(0,-2.54)
SMA-TH_BWSMA-KE-Z001
  round 2 hole 1.35: 1(0,0)
  round 2.2 hole 1.5: 2(-2.55,2.55) 2(-2.55,-2.55) 2(2.55,2.55) 2(2.55,-2.55)
SMA-TH_BWSMA-KWE-Z001
  round 2.2 hole 1.6: 1(-2.55,-2.55) 2(-2.55,2.55) 3(2.55,2.55) 4(2.55,-2.55)
  round 2 hole 1.3: 5(0,0)
SMB_L4.4-W3.6-LS5.3-RD
  rect 2x2.4 smd: 1(-2.4,0) 2(2.4,0)
SMB_L4.6-W3.5-LS5.3-RD
  rect 2.047x2.241 smd: 1(-2.591,0) 2(2.591,0)
SOIC-8_L4.9-W3.9-P1.27-LS6.0-BL
  oval 0.588x2.045 smd: 1(-1.905,-2.772) 2(-0.635,-2.772) 3(0.635,-2.772) 4(1.905,-2.772) 5(1.905,2.772) 6(0.635,2.772) 7(-0.635,2.772) 8(-1.905,2.772)
SOIC-8_L5.0-W4.0-P1.27-LS6.1-BL
  oval 0.569x1.95 smd: 1(-1.905,-2.705) 2(-0.635,-2.705) 3(0.635,-2.705) 4(1.905,-2.705) 5(1.905,2.705) 6(0.635,2.705) 7(-0.635,2.705) 8(-1.905,2.705)
SOT-223-4_L6.5-W3.5-P2.30-LS7.0-BR
  rect 2.47x0.98 smd: 1(2.835,-2.3) 2(2.835,0) 3(2.835,2.3)
  rect 2.47x3.6 smd: 4(-2.835,0)
螺丝孔-3MM
  round 4.5 hole 3.1: 1(0,0)

## Nets
+5V: C1#2.2 C2#2.2 C3.1 C10#2.1 D2#2.1 LED1#3.1 U2.7
-5V: C1#2.1 C5.1 C6.2 C11#2.2 D1.2 LED2#3.2 U2.4
GND: 3K.3 10uf.1 10uf#2.2 100n.1 100n#2.1 100nF.2 100nF4.1 - GND +.2 C2.2 C2#2.1 C3.2 C3#2.1 C4.2 C5.2 C5#2.2 C6.1 C6#2.2 C7.1 C8.1 C8#2.1 C9.2 C9#2.1 C10.2 C10#2.2 C11.2 C11#2.1 C12.1 C13.1 D3.2 GND.1 GND.2 GND.3 GND.4 GND.5 GND.6 GND.7 GND.8 H1.2 H2.2 IN1.2 IN2.2 IN3.2 OUT1.2 R.2 R1.1 R7.1 R8.1 R8#3.2 R9#2.2 R10.1 R11.1 R12.1 RG1.1 S1.2 T1.1 T1#2.1 T2.1 T2#2.1 T3.1 T3#2.1 T4.1 T4#2.1 VCCGNDVEE.2 VCCGNDVEE1.2 反1.1 反1.2 反1.3 反1.4 反2.1 反2.2 反2.3 反2.4 反向接地.2 接地.1 接地#2.1 接地#3.1 接地#4.1 正1.1 正1.2 正1.3 正1.4 正2.1 正2.2 正2.3 正2.4 正向接地.1 输出.1 输出.2 输出.3 输出.4
VCC: 10uf.2 100n.2 100nF4.2 C6#2.1 C7.2 C8.2 C9.1 D2.1 D2#3.1 LED1.1 LED1#2.1 U1.7 U1#2.7 U2#2.3
VEE: 10uf#2.1 100n#2.2 100nF.1 C10.1 C11.1 C12.2 D1#2.2 D1#3.2 LED2.2 LED2#2.2 U1.4 U1#2.4
VIN: D3.1 H1.1 R5#2.1
3K_1: 3K.1 R9.1
D1_1: D1.1 D1#2.1 VCCGNDVEE.1 VCCGNDVEE1.1
D2_2: D2.2 D2#2.2 VCCGNDVEE.3 VCCGNDVEE1.3
IN1_1: IN1.1 R2.1
IN2_1: IN2.1 R4.1
IN3_1: IN3.1 R7#2.1
OUT1_1: C13.2 OUT.1 OUT.2 OUT1.1 R6.2
R1_1: C1.2 C2.1 C3#2.2 C5#2.1 R1#2.1 R3.2 R5.2 R8#2.2 U1#2.2
R1_2: C1.1 C8#2.2 C14.1 R1.2 R1#2.2 R5#2.2 U1#2.6 U2.3
R2_1: R2#2.1 R6#3.2
R2_2: R2#2.2 RF.2 U2.6
R3_1: R2.2 R3.1
R4_2: R4.2 R5.1
R6_1: C14.2 R6.1 R13.2
R7_2: LED2#3.1 R7.2 R7#2.2 R8#2.1
R8_2: LED1#3.2 R8.2
R10_2: LED1#2.2 R10.2
R11_2: LED2#2.1 R11.2
RF_1: RF.1 RG1.2 U2.2
U1_3: R12.2 U1#2.3
U2_1: 3K.2 U2#2.1
U2_2: C4.1 R9.2 R13.1 U2#2.2 U2#2.4
VOUT: C9#2.2 H2.1 R6#3.1 S1.1
$1N1330: R1#3.2 串.1
$1N1539: R.1 Rout.2 输出.5 输出1.1 输出1.2
$1N2313: R4#2.1 反1.5 直流偏置.1 直流偏置.2
$1N2329: R5#3.1 正1.5 直流偏置#2.1 直流偏置#2.2
$1N2340: R5#3.2 开#2.1 接地#2.2
$1N2343: R6#2.1 正2.5 直流偏置接电源2.1 直流偏置接电源2.2
$1N2357: R6#2.2 开#3.1 接地#3.2
$1N2360: R4#2.2 开.1 接地.2
$1N2447: R7#3.2 反2.5 直流偏置#3.1 直流偏置#3.2
$1N2462: R7#3.1 开#4.2 接地#4.2
$1N3241: C5#3.1 C6#3.1 R1#3.1 U1.2 反向接地.1 开.2 开#4.1
$1N5425: LED1.2 R8#3.1
$1N5450: LED2.1 R9#2.1
$1N6559: - GND +.3 D1#3.1
$1N6606: - GND +.1 D2#3.2
$1N9697: C5#3.2 C6#3.2 Rout.1 U1.6 串.2
$1N9711: U1.3 开#2.2 开#3.2 正向接地.2

Pads without a net: SCREW1 1; SCREW2 1; SCREW3 1; SCREW4 1; U1 1 5 8; U1#2 1 5 8; U2 1 5 8

## Via types
v1: diameter 0.61, hole 0.305, Top Layer to Bottom Layer, 486 vias

## Routing (per net, layer and track width the routed paths; a pad name or vN(x,y) marks a point on that pad's centre or on a via; arc(x,y) is an arc through that point)
+5V: length 22.1
  Top Layer w0.6: D2#2.1 60.94,30.26 C3.1 59.87,35.1 59.87,37.08
  Top Layer w0.8: v1(67.2,22.35) 67.58,22.73 U2.7 67.58,25.64 67.44,25.78
  Top Layer w1.2: D2#2.1 66.06,30.23 67.51,28.77 67.51,25.85 67.44,25.78
  Bottom Layer w0.8: 66.31,22.21 66.46,22.35 v1(67.2,22.35)
-5V: length 32
  Top Layer w0.6: v1(62.38,15.75) D1.2 60.94,15.72 C6.2 59.62,10.74 59.62,9.02
  Top Layer w0.8: v1(69.87,19.3) 69.87,18.38 U2.4 72.28,18.15 74.26,18.15 C11#2.2 74.57,17.84 v1(74.57,17.02)
  Bottom Layer w0.8: C1#2.1 68.97,20.21 v1(69.87,19.3)
  Bottom Layer w1.2: v1(62.38,15.75) 73.3,15.75 v1(74.57,17.02)
GND: length 17.8
  Top Layer w0.254: GND.8 GND.7 GND.5 GND.4 GND.3 GND.2 GND.1
  vias: v1(0.94,80.98) v1(0.94,78.44) v1(0.94,75.9) v1(0.94,73.36) v1(0.94,70.82) v1(0.94,68.28) v1(0.94,65.73) v1(0.94,63.2) v1(0.94,60.66) v1(0.94,58.12) v1(0.94,55.58) v1(0.94,53.04) v1(0.94,50.5) v1(0.94,47.96) v1(0.94,45.42) v1(1.33,41.22) v1(1.33,39.22) v1(1.33,37.22) v1(1.33,35.22) v1(1.33,29.22) v1(1.33,25.22) v1(1.33,19.22) v1(1.33,15.22) v1(1.33,5.22) v1(1.33,3.22) v1(1.33,1.22) v1(2.84,73.36) v1(3.33,35.22) v1(3.33,25.22) v1(3.33,15.22) v1(3.48,75.9) v1(3.48,58.12) v1(3.48,53.04) v1(3.48,50.5) v1(5.33,35.22) v1(5.33,33.22) v1(5.33,27.22) v1(5.33,25.22) v1(5.33,23.22) v1(5.33,17.22) v1(5.33,15.22) v1(5.33,13.22) v1(5.33,7.22) v1(6.02,80.98) v1(6.02,75.9) v1(6.02,70.82) v1(6.02,63.2) v1(6.02,60.66) v1(6.02,55.58) v1(6.02,53.04) v1(6.02,50.5) v1(6.02,47.96) v1(6.02,45.42) v1(7.33,41.22) v1(7.33,39.22) v1(7.33,37.22) v1(7.33,35.22) v1(7.33,25.22) v1(7.33,15.22) v1(7.33,5.22) v1(7.33,3.22) v1(7.33,1.22) v1(8.56,80.98) v1(8.56,75.9) v1(8.56,47.96) v1(8.76,21.46) v1(8.76,18.8) v1(8.76,8.89) v1(8.89,11.68) v1(9.02,31.37) v1(9.02,28.7) v1(9.33,41.22) v1(9.33,39.22) v1(9.33,33.22) v1(9.33,27.22) v1(9.33,25.22) v1(9.33,23.22) v1(9.33,17.22) v1(9.33,15.22) v1(9.33,13.22) v1(9.33,7.22) v1(9.33,5.22) v1(9.33,3.22) v1(9.33,1.22) v1(9.52,21.46) v1(9.52,18.8) v1(9.52,8.89) v1(9.65,11.68) v1(9.78,31.37) v1(9.78,28.7) v1(10.29,21.46) v1(10.29,18.8) v1(10.29,8.89) v1(10.41,11.68) v1(10.54,31.37) v1(10.54,28.7) v1(11.1,73.36) v1(11.1,47.96) v1(11.05,21.46) v1(11.05,18.8) v1(11.05,8.89) v1(11.18,11.68) v1(11.3,31.37) v1(11.3,28.7) v1(11.33,41.22) v1(11.33,39.22) v1(11.33,27.22) v1(11.33,25.22) v1(11.33,17.22) v1(11.33,15.22) v1(11.33,7.22) v1(11.33,5.22) v1(11.33,3.22) v1(11.33,1.22) v1(11.81,21.46) v1(11.81,18.8) v1(11.81,8.89) v1(11.94,11.68) v1(12.06,31.37) v1(12.06,28.7) v1(12.57,21.46) v1(12.57,18.8) v1(12.57,8.89) v1(12.7,11.68) v1(12.83,31.37) v1(12.83,28.7) v1(13.33,41.22) v1(13.33,39.22) v1(13.33,27.22) v1(13.33,25.22) v1(13.33,21.46) v1(13.33,18.8) v1(13.33,17.22) v1(13.33,15.22) v1(13.33,8.89) v1(13.33,7.22) v1(13.33,5.22) v1(13.33,3.22) v1(13.33,1.22) v1(13.46,11.68) v1(13.59,31.37) v1(13.59,28.7) v1(13.64,47.96) v1(14.1,21.46) v1(14.1,18.8) v1(14.1,8.89) v1(14.22,11.68) v1(14.35,31.37) v1(14.35,28.7) v1(14.86,21.46) v1(14.86,18.8) v1(14.86,8.89) v1(14.99,11.68) v1(15.11,31.37) v1(15.11,28.7) v1(15.33,41.22) v1(15.33,27.22) v1(15.33,25.22) v1(15.33,17.22) v1(15.33,15.22) v1(15.33,7.22) v1(15.33,5.22) v1(15.33,3.22) v1(15.33,1.22) v1(15.62,21.46) v1(15.62,18.8) v1(15.62,8.89) v1(15.75,11.68) v1(15.88,31.37) v1(15.88,28.7) v1(16.18,73.36) v1(16.18,63.2) v1(16.18,55.58) v1(16.18,50.5) v1(16.18,47.96) v1(16.38,21.46) v1(16.38,18.8) v1(16.38,8.89) v1(16.51,11.68) v1(16.64,31.37) v1(16.64,28.7) v1(17.14,21.46) v1(17.14,18.8) v1(17.14,8.89) v1(17.27,11.68) v1(17.33,41.22) v1(17.4,31.37) v1(17.4,28.7) v1(17.33,25.22) v1(17.33,23.22) v1(17.33,17.22) v1(17.33,15.22) v1(17.33,7.22) v1(17.33,5.22) v1(17.33,3.22) v1(17.33,1.22) v1(18.03,11.68) v1(18.16,31.37) v1(18.92,31.37) v1(18.92,11.81) v1(19.18,73.28) v1(19.18,71.1) v1(19.33,37.22) v1(19.33,5.35) v1(19.43,15.49) v1(19.43,14.73) v1(19.43,13.97) v1(19.43,13.21) v1(19.43,12.32) v1(19.69,31.12) v1(19.69,26.8) v1(19.69,26.04) v1(19.69,25.27) v1(19.69,24.51) v1(19.69,23.75) v1(19.69,22.99) v1(19.69,22.23) v1(19.81,21.46) v1(20.19,30.48) v1(20.19,10.03) v1(20.32,20.96) v1(20.7,10.8) v1(20.83,29.97) v1(21.21,11.43) v1(21.26,78.44) v1(21.26,53.04) v1(21.26,47.96) v1(21.33,37.22) v1(21.33,31.22) v1(21.34,29.34) v1(21.33,9.22) v1(21.33,7.22) v1(21.33,5.47) v1(21.46,28.58) v1(21.46,27.81) v1(21.46,27.05) v1(21.46,26.29) v1(21.46,25.4) v1(21.46,24.64) v1(21.46,23.88) v1(21.46,23.11) v1(21.46,22.35) v1(21.46,13.21) v1(21.46,12.32) v1(21.59,73.28) v1(21.59,70.77) v1(22.1,21.72) v1(22.73,21.21) v1(23.33,41.22) v1(23.33,37.22) v1(23.33,31.22) v1(23.33,29.22) v1(23.33,13.22) v1(23.33,11.22) v1(23.33,9.22) v1(23.33,7.73) v1(23.8,55.58) v1(23.8,50.5) v1(23.8,47.96) v1(24,80.9) v1(24,78.49) v1(24,75.01) v1(25.33,41.22) v1(25.33,35.22) v1(25.33,31.22) v1(25.33,29.22) v1(25.33,9.22) v1(25.33,7.73) v1(26.29,80.9) v1(26.34,55.58) v1(26.34,50.5) v1(26.34,47.96) v1(27.33,41.22) v1(27.33,37.22) v1(27.33,35.22) v1(27.33,33.22) v1(27.33,29.22) v1(27.33,9.22) v1(27.33,7.73) v1(28.7,75.06) v1(28.88,80.98) v1(28.88,55.58) v1(28.88,50.5) v1(28.88,47.96) v1(28.88,45.42) v1(29.33,41.22) v1(29.33,37.22) v1(29.33,35.22) v1(29.33,33.22) v1(29.33,31.22) v1(29.33,9.22) v1(29.33,7.22) v1(29.33,5.22) v1(29.33,3.22) v1(29.33,1.22) v1(30.45,75.06) v1(31.33,41.22) v1(31.33,35.22) v1(31.33,33.22) v1(31.33,31.22) v1(31.33,29.22) v1(31.33,13.22) v1(31.33,11.22) v1(31.33,9.22) v1(31.33,7.22) v1(31.33,5.22) v1(31.33,3.22) v1(31.33,1.22) v1(31.42,80.98) v1(31.42,53.04) v1(31.42,50.5) v1(31.42,47.96) v1(31.42,45.42) v1(31.75,73.15) v1(31.75,70.7) v1(31.75,68.87) v1(31.75,66.53) v1(33.33,41.22) v1(33.33,37.22) v1(33.33,35.22) v1(33.33,33.22) v1(33.33,31.22) v1(33.33,29.22) v1(33.33,27.22) v1(33.33,11.22) v1(33.33,9.22) v1(33.33,7.22) v1(33.33,5.22) v1(33.33,3.22) v1(33.33,1.22) v1(33.96,78.44) v1(33.96,73.36) v1(34.04,70.74) v1(34.11,68.83) v1(34.11,63.88) v1(34.29,66.55) v1(35.33,27.22) v1(35.33,25.22) v1(35.33,1.22) v1(36.5,80.98) v1(36.5,75.9) v1(36.5,70.82) v1(36.5,69.42) v1(36.5,66.5) v1(36.58,63.88) v1(37.33,1.22) v1(39.04,78.44) v1(39.04,70.82) v1(39.17,69.42) v1(39.33,41.22) v1(39.33,31.22) v1(39.33,29.22) v1(39.33,27.22) v1(39.33,25.22) v1(39.33,23.22) v1(39.33,1.22) v1(41.33,41.22) v1(41.33,31.22) v1(41.33,29.22) v1(41.33,27.22) v1(41.33,25.22) v1(41.33,23.22) v1(41.33,1.22) v1(41.58,80.98) v1(41.58,75.9) v1(41.58,70.82) v1(41.58,55.83) v1(41.58,45.42) v1(41.71,66.5) v1(41.83,69.29) v1(43.33,41.22) v1(43.33,39.22) v1(43.33,33.22) v1(43.33,31.22) v1(43.33,25.22) v1(43.33,23.22) v1(43.33,3.22) v1(43.33,1.22) v1(44.12,80.98) v1(44.12,75.9) v1(44.12,55.7) v1(44.5,70.56) v1(44.5,69.29) v1(44.5,64.21) v1(45.33,41.22) v1(45.33,33.22) v1(45.33,31.22) v1(45.33,29.22) v1(45.33,27.22) v1(45.33,25.22) v1(45.33,23.22) v1(45.33,7.22) v1(45.33,5.22) v1(45.33,1.22) v1(47.33,37.22) v1(47.33,35.22) v1(47.33,33.22) v1(47.33,29.22) v1(47.33,27.22) v1(47.33,23.22) v1(47.33,11.22) v1(47.33,9.22) v1(47.33,7.22) v1(49.33,35.22) v1(49.33,33.22) v1(49.33,13.22) v1(49.33,11.22) v1(49.33,9.22) v1(49.33,7.22) v1(51.33,37.22) v1(51.33,35.22) v1(51.33,33.22) v1(51.33,31.22) v1(51.33,29.22) v1(51.33,27.22) v1(51.33,25.22) v1(51.33,23.22) v1(51.33,19.22) v1(51.33,13.22) v1(51.33,11.22) v1(51.33,9.22) v1(51.33,7.22) v1(55.81,40.2) v1(55.81,37.2) v1(55.81,34.2) v1(55.81,25.2) v1(55.81,22.2) v1(55.81,10.2) v1(55.81,7.2) v1(58.81,34.2) v1(58.81,31.2) v1(58.81,28.2) v1(58.81,16.2) v1(58.81,13.2) v1(61.36,25.27) v1(61.81,43.2) v1(61.81,37.2) v1(61.74,28.45) v1(61.74,21.97) v1(61.81,7.2) v1(61.81,4.2) v1(61.81,1.2) v1(61.87,40.39) v1(62,19.43) v1(64.81,37.2) v1(64.81,34.2) v1(64.81,13.2) v1(64.81,10.2) v1(67.81,34.2) v1(67.81,31.2) v1(67.81,1.2) v1(70.81,4.2) v1(73.81,43.2) v1(73.81,40.2) v1(73.81,37.2) v1(73.81,34.2) v1(73.81,31.2) v1(73.81,28.2) v1(73.81,25.2) v1(73.81,22.2) v1(73.81,13.2) v1(73.81,7.2) v1(73.81,4.2) v1(73.81,1.2) v1(76.81,40.2) v1(76.81,37.2) v1(76.81,34.2) v1(76.81,31.2) v1(76.81,28.2) v1(76.81,25.2) v1(76.81,22.2) v1(76.81,19.2) v1(76.81,16.2) v1(76.81,13.2) v1(76.81,10.2) v1(76.81,7.2)
VCC: length 80.7
  Top Layer w0.254: v1(32.89,60.45) 32.23,60.45 31.34,59.56 U1.7 ; v1(33.78,51.82) D2#3.1
  Top Layer w0.5: 39.12,20.45 39.75,19.81 39.75,17.15 40.77,16.13 41.67,16.13 C6#2.1
  Top Layer w0.6: 39.12,20.45 33.91,20.45 31.89,22.46
  Top Layer w0.762: 10uf.2 44.5,51.15 LED1.1 39.62,51.05 37.97,49.4 34.37,49.4 D2#3.1
  Top Layer w0.8: D2.1 13.13,34.43 13.08,34.38 ; C6#2.1 44.72,8.34 U2#2.3
  Top Layer w1: D2.1 24.24,34.43 31.89,26.78 C7.2 C8.2 31.89,20.72 31.24,20.07 U1#2.7
  Bottom Layer w0.254: v1(32.89,60.45) 33.74,59.6 33.74,51.82
VEE: length 59.9
  Top Layer w0.254: 22.21,56.9 24.66,56.9 U1.4 ; v1(20.57,49.28) 18.8,49.28 18.73,49.35
  Top Layer w0.762: 10uf#2.1 100nF.1 12.52,50.31 LED2.2 13.48,49.35 D1#3.2
  Top Layer w1: v1(30.86,15.37) 28.72,15.37 C11.1 C10.1 24.47,17.3 U1#2.4 ; D1#2.2 36.46,34.44 40.13,34.44 ; D1#2.2 36.07,34.05 ; D1#2.2 36.45,33.92 v1(36.45,29.08) ; C12.2 42.34,34.44 43.05,35.14
  Bottom Layer w0.254: v1(22.23,56.85) 22.23,50.93 v1(20.57,49.28)
  Bottom Layer w1: v1(30.86,15.37) 36.45,20.96 v1(36.45,29.08)
VIN: length 10.3
  Top Layer w0.6: 68.6,9.29 D3.1 64.66,4.57 H1.1
3K_1: length 4.5
  Top Layer w0.8: R9.1 36.32,3.68 3K.1
D1_1: length 11.2
  Top Layer w0.8: VCCGNDVEE.1 30.99,38.35 31.88,39.24 36.2,39.24 D1#2.1
  Top Layer w1.2: 56.17,15.75 56.17,19.06 VCCGNDVEE1.1
D2_2: length 11.5
  Top Layer w0.8: VCCGNDVEE.3 24.9,39.23 20.07,39.23
  Top Layer w1.2: VCCGNDVEE1.3 57.55,25.65 56.17,27.04 56.17,30.23
IN1_1: length 5.4
  Top Layer w0.8: IN1.1 R2.1
IN2_1: length 5.4
  Top Layer w0.8: IN2.1 R4.1
IN3_1: length 5.4
  Top Layer w0.8: IN3.1 R7#2.1
OUT1_1: length 19.8
  Top Layer w0.8: R6.2 OUT1.1 48.64,19.05 OUT.1 OUT.2
R1_1: length 42.8
  Top Layer w0.8: R5.2 16.64,20.05 C3#2.2 22.06,20.05 ; R8#2.2 16.51,10.27 C5#2.1 18.8,10.29 20.57,12.06 20.57,18.57 22.06,20.05 ; 22.45,20.05 20.57,21.93 20.57,28.83 19.32,30.08 C2.1 16.51,30.08 R3.2 ; C1.2 R1#2.1 26.05,20.84 25.27,20.07 U1#2.2 24.46,20.05 22.06,20.05 ; 22.06,20.05 22.25,20.24
R1_2: length 19.5
  Top Layer w0.6: 29.03,18.8 28.96,18.8 28.07,19.69 C1.1 ; C8#2.2 R5#2.2 68.74,11.43 68.74,13.59 68.85,13.7 U2.3 ; C14.1 32.15,18.8 U1#2.6
R2_1: length 2.6
  Top Layer w0.6: R2#2.1 R6#3.2
R2_2: length 10.4
  Top Layer w0.6: R2#2.2 70.12,25.65 68.85,24.38 U2.6 68.85,22.48 67.84,21.46 RF.2
R3_1: length 2.3
  Top Layer w0.8: R2.2 R3.1
R4_2: length 2.4
  Top Layer w0.8: R4.2 R5.1
R6_1: length 4.3
  Top Layer w0.8: R6.1 34.43,18.8 34.42,18.78
R7_2: length 4.9
  Top Layer w0.6: 57.57,6.48 57.57,8.97 57.52,9.02
  Top Layer w0.8: R8#2.1 12.3,10.29 R7#2.2
R8_2: length 2.6
  Top Layer w0.6: 57.77,37.08 57.57,37.29 57.57,39.62
R10_2: length 2.6
  Top Layer w1: 13.08,36.48 10.59,36.48 R10.2
R11_2: length 2.4
  Top Layer w1: R11.2 43.1,37.2 43.05,37.25
RF_1: length 7.1
  Top Layer w0.6: 67.32,15.88 67.58,16.14 U2.2 67.58,18.8 66.82,19.56 64.01,19.56 63.9,19.45
U1_3: length 2.4
  Top Layer w0.8: U1#2.3 23,18.8 R12.2
U2_1: length 3.6
  Top Layer w0.8: U2#2.1 38.85,3.7 3K.2
U2_2: length 18.8
  Top Layer w0.6: 36.32,10.02 36.32,10.02 38.86,10.03 41.15,7.75 U2#2.2
  Top Layer w0.8: R13.1 36.58,13.57 ; 36.58,13.57 C4.1 ; 36.58,13.57 36.58,10.27 R9.2 ; 36.58,13.57 37.41,12.74 U2#2.4
VOUT: length 14.7
  Top Layer w0.6: R6#3.1 C9#2.2 70.12,41.15 S1.1 65.04,42.04 H2.1
$1N1330: length 2.8
  Top Layer w0.254: 26.4,63.25 28.97,63.25 29.1,63.37
$1N1539: length 14.8
  Top Layer w0.254: 41.91,63.88 41.91,58.42 ; 41.91,58.42 41.91,58.04 ; 41.91,58.42 41.89,58.4 R.1 ; 41.91,58.42 44.45,58.42 ; Rout.2 38.08,58.29 38.23,58.15
$1N2313: length 14.3
  Top Layer w0.254: 13.86,70.48 13.59,70.76 13.59,77.22 直流偏置.2 反1.5 ; 直流偏置.1 12.83,77.47
$1N2329: length 14.7
  Top Layer w0.254: 5.21,72.9 6.1,73.79 7.37,73.79 7.43,73.72 7.56,73.72 7.62,73.79 ; 5.21,72.9 5.08,73.03 ; 5.21,72.9 5.21,67.18 6.33,66.06 10.15,66.06 10.56,65.66
$1N2340: length 6.1
  Top Layer w0.254: 16.4,65.79 16.27,65.66 12.56,65.66 12.56,63.63 12.68,63.5
$1N2343: length 13.1
  Top Layer w0.254: 10.68,60.2 10.68,55.61 直流偏置接电源2.2 直流偏置接电源2.1 ; 10.68,60.2 R6#2.1 ; 10.68,60.2 9.03,58.55 正2.5
$1N2357: length 5.2
  Top Layer w0.254: R6#2.2 15.51,60.33 ; 开#3.1 16.02,60.33 16.02,58.17
$1N2360: length 4.7
  Top Layer w0.254: 开.1 接地.2 R4#2.2
$1N2447: length 19.4
  Top Layer w0.254: R7#3.2 35.05,77.09 反2.5 35.56,73.03 35.74,72.85 40.44,72.85 直流偏置#3.2 直流偏置#3.1
$1N2462: length 7.3
  Top Layer w0.254: 开#4.2 26.42,72.63 接地#4.2 R7#3.1
$1N3241: length 35.5
  Top Layer w0.254: C6#3.1 26.69,66.18 24.78,64.28 R1#3.1 24.78,62.21 25.27,61.72 26.16,61.72 26.67,61.21 26.67,59.82 26.42,59.56 U1.2 22.73,59.56 22.23,60.07 22.23,61.85 21.32,62.75 反向接地.1 ; 开.2 20.3,67.29 19.81,66.8 19.81,64.14 21.19,62.75 反向接地.1 ; 反向接地.1 21.32,62.87 22.48,62.87 23.62,64.01 开#4.1
$1N5425: length 2.6
  Top Layer w0.762: R8#3.1 39.45,53.07 LED1.2
$1N5450: length 2.6
  Top Layer w0.762: LED2.1 14.91,52.36 R9#2.1
$1N6559: length 6
  Top Layer w0.762: D1#3.1 21.96,54.53 - GND +.3
$1N6606: length 6
  Top Layer w0.762: - GND +.1 31.25,55.17 D2#3.2
$1N9697: length 18
  Top Layer w0.254: Rout.1 U1.6 28.83,58.29 28.45,58.67 28.45,60.96 29.08,61.6 29.59,61.6 30.84,62.85 串.2 30.84,64.02 28.56,66.31 C5#3.2 28.69,66.93 C6#3.2
$1N9711: length 13.8
  Top Layer w0.254: U1.3 20.07,58.29 18.02,60.34 18.02,65.66 18.64,66.28

## Copper pours and planes (outline as drawn; the poured copper is in the pictures)
GND on Top Layer: -0.13,82.8 85.22,82.8 85.22,-2.67 -0.13,-2.67
GND on Bottom Layer: 0,42.48 56.77,42.61 56.77,-6.03 -0.38,-6.03 -0.38,-3.37
GND on Bottom Layer: -3.17,85.98 83.82,85.98 83.82,-3.56 -3.17,-3.56

Small or netless copper shapes (teardrops, artwork), in the pictures only: 52 on Top Layer, 2 on Bottom Layer

## Text on the board
Top Layer: 反向加法器 | by-LJL | 同反向放大/ / 加减法/ / 积分微分
Top Silkscreen Layer: GND | IN | OUT | VCC | VEE | LJL | OPA695同相电流反馈 | 供电电压：±5V
